# Altium project Thunderscope-E.PrjPCB (part 1 of 2)
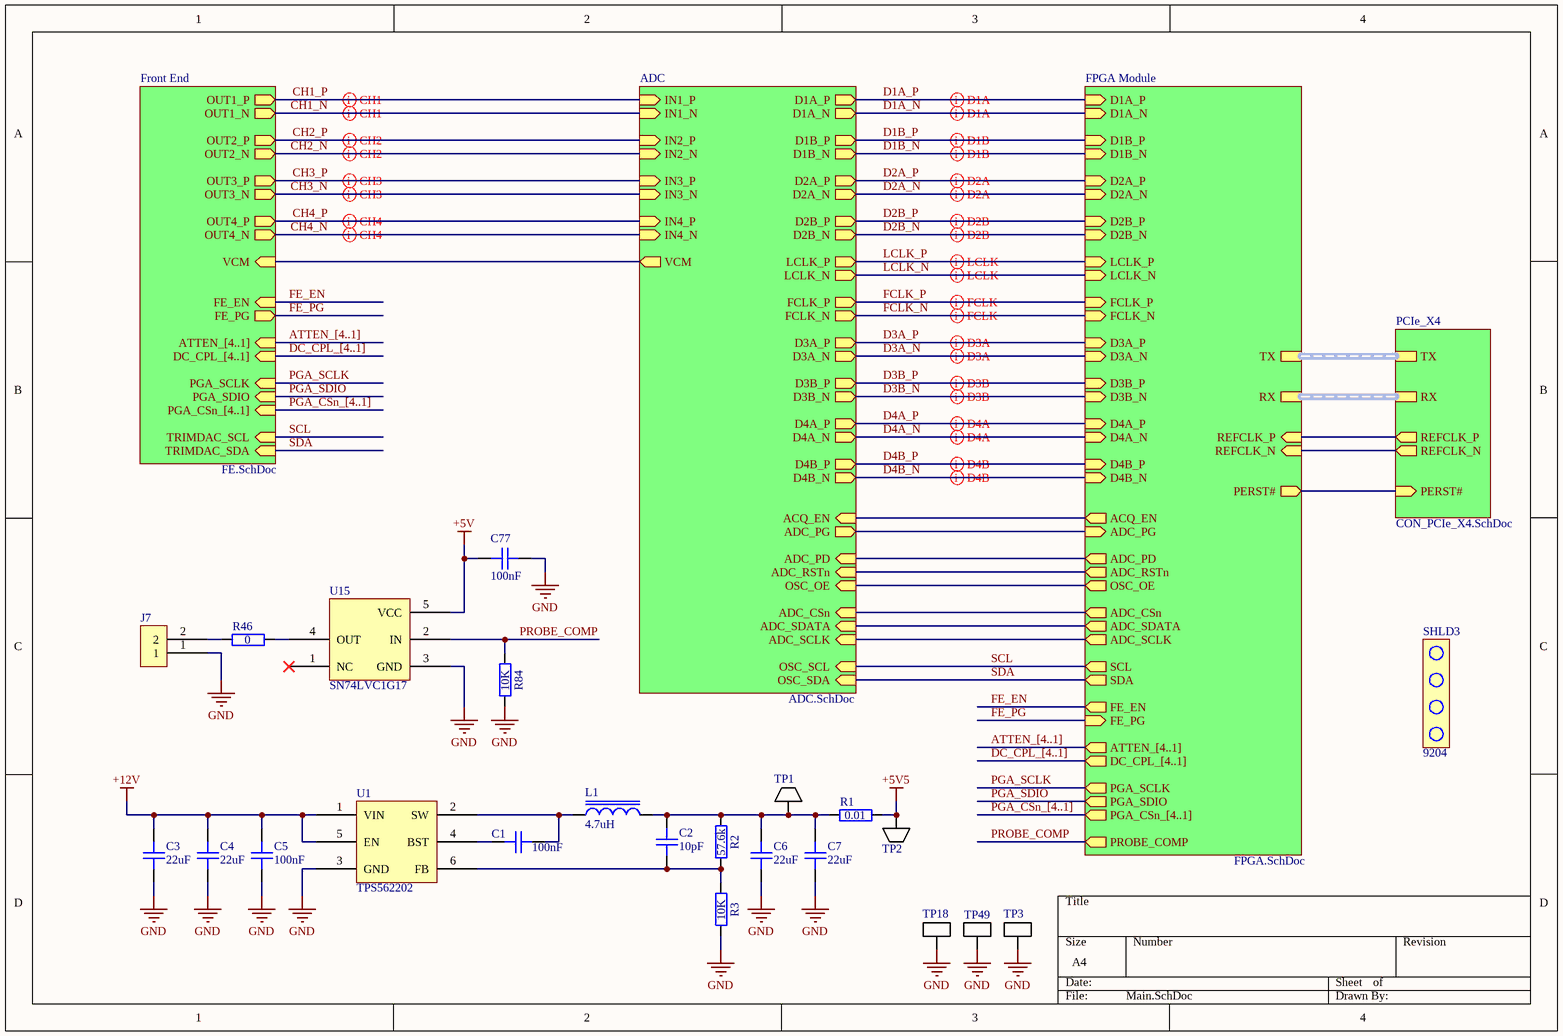
[diagram p0: Main.SchDoc]
Template Notes: - Nominal values used, dimensions in mm  - The mounting holes and keep-out areas around them are only required when the I/O bracket is mounted on the card directly  - Component height rule and clearance rule derived from PCI_Express_CEM_r2.0.pdf, Page 84.  - Stackup is not specified in PCI_Express_CEM_r2.0.pdf, nor implemented in this template.; Template Revision Date: Oct 29, 2010; Template Source Document: Outline:PCI_Express_CEM_r2.0.pdf  Pinout:PCI_Express_CEM_r2.0.pdf; Template Source Organization: PCI-SIG; Template Source Revision Date: R2.0, April 11, 2007; Template Source URL: http://www.pcisig.com
9 sheets, 467 parts. Net scope: hierarchical (ports join the sheet entries above them; power ports are global).
Board file: Thunderscope-E.PCBDOC
Sheets:
  Main.SchDoc
    Front End = FE.SchDoc
      CH1 = FE_Channel.SchDoc
        Input Coupling and Attenuation = Input.SchDoc
        Buffer = Buffer.SchDoc
        PGA = PGA.SchDoc
      CH2 = FE_Channel.SchDoc
        Input Coupling and Attenuation = Input.SchDoc
        Buffer = Buffer.SchDoc
        PGA = PGA.SchDoc
      CH3 = FE_Channel.SchDoc
        Input Coupling and Attenuation = Input.SchDoc
        Buffer = Buffer.SchDoc
        PGA = PGA.SchDoc
      CH4 = FE_Channel.SchDoc
        Input Coupling and Attenuation = Input.SchDoc
        Buffer = Buffer.SchDoc
        PGA = PGA.SchDoc
    ADC = ADC.SchDoc
    FPGA Module = FPGA.SchDoc
    PCIe_X4 = CON_PCIe_X4.SchDoc

## Sheet Main.SchDoc
size A4

### Parts
C1  100nF  [GEN_C_0402]
C2  10pF  [GEN_C_0402]
C3  22uF  [GEN_C_0805]
C4  22uF  [GEN_C_0805]
C5  100nF  [GEN_C_0402]
C6  22uF  [GEN_C_0805]
C7  22uF  [GEN_C_0805]
C77  100nF  [GEN_C_0402]
J7  TSW-101-08-F-D-RA  [GEN_2.54mm_1x2_Pin_TH_RA]  (value not drawn)
L1  4.7uH  [TY_IND_NRS5030]
R1  0.01  [GEN_R_0603]
R2  57.6k  [GEN_R_0402]
R3  10K  [GEN_R_0402]
R46  0  [GEN_R_0402]
R84  10K  [GEN_R_0402]
SHLD3  9204
TP1  5015  [KEY_5015]  (value not drawn)
TP2  5015  [KEY_5015]  (value not drawn)
TP3  5019  [KEY_5019]  (value not drawn)
TP18  5019  [KEY_5019]  (value not drawn)
TP49  5019  [KEY_5019]  (value not drawn)
U1  TPS562202  [TI_SOT563_DRL0006A]
U15  SN74LVC1G17  [GEN_SC-70-5]

### Sub-sheets
ADC = ADC.SchDoc: IN4_N (in), IN4_P (in), IN3_N (in), IN3_P (in), IN2_N (in), IN2_P (in), VCM (out), IN1_N (in), IN1_P (in), ADC_CSn (in), ADC_SDATA (in), ADC_SCLK (in), ADC_RSTn (in), ADC_PD (in), D1A_N (out), D1A_P (out), D1B_P (out), D1B_N (out), D2A_P (out), D2A_N (out), D2B_N (out), D2B_P (out), LCLK_P (out), LCLK_N (out), FCLK_N (out), FCLK_P (out), D3A_P (out), D3A_N (out), D3B_P (out), D3B_N (out), D4A_P (out), D4A_N (out), D4B_P (out), D4B_N (out), ACQ_EN (in), ADC_PG (out), OSC_OE (in), OSC_SDA (in), OSC_SCL (in)
FPGA Module = FPGA.SchDoc: PERST# (out), REFCLK_N (in), REFCLK_P (in), D1A_P (in), D1A_N (in), D1B_P (in), D1B_N (in), D2A_P (in), D2A_N (in), D2B_P (in), D2B_N (in), LCLK_P (in), LCLK_N (in), FCLK_P (in), FCLK_N (in), D3A_P (in), D3A_N (in), D3B_P (in), D3B_N (in), D4A_P (in), D4A_N (in), D4B_P (in), D4B_N (in), ACQ_EN (out), ADC_PG (in), ADC_PD (out), ADC_RSTn (out), OSC_OE (out), ADC_CSn (out), ADC_SDATA (out), ADC_SCLK (out), SCL (out), SDA (out), FE_EN (out), FE_PG (in), ATTEN_[4..1] (out), DC_CPL_[4..1] (out), PGA_SCLK (out), PGA_SDIO (out), PGA_CSn_[4..1] (out), RX (harness PCIe_X4_RX), TX (harness PCIe_X4_TX), PROBE_COMP (out)
Front End = FE.SchDoc: OUT1_P (out), OUT1_N (out), OUT3_P (out), OUT3_N (out), OUT4_N (out), OUT2_N (out), OUT2_P (out), OUT4_P (out), VCM (in), DC_CPL_[4..1] (in), ATTEN_[4..1] (in), PGA_SCLK (in), PGA_CSn_[4..1] (in), PGA_SDIO (in), TRIMDAC_SCL (in), TRIMDAC_SDA (in), FE_EN (in), FE_PG (out)
PCIe_X4 = CON_PCIe_X4.SchDoc: REFCLK_N (out), PERST# (in), REFCLK_P (out), TX (harness PCIe_X4_TX), RX (harness PCIe_X4_RX)

### Nets
+5V: C77.1 U15.5(VCC)
+5V5: R1.2 TP2.1
+12V: C3.2 C4.2 C5.1 U1.1(VIN) U1.5(EN)
GND: C3.1 C4.1 C5.2 C6.1 C7.1 C77.2 J7.1 R3.1 R84.1 TP3.1 TP18.1 TP49.1 U1.3(GND) U15.3(GND)
ACQ_EN: sheet ADC/ACQ_EN, sheet FPGA Module/ACQ_EN
ADC_CSn: sheet ADC/ADC_CSn, sheet FPGA Module/ADC_CSn
ADC_PD: sheet ADC/ADC_PD, sheet FPGA Module/ADC_PD
ADC_PG: sheet ADC/ADC_PG, sheet FPGA Module/ADC_PG
ADC_RSTn: sheet ADC/ADC_RSTn, sheet FPGA Module/ADC_RSTn
ADC_SCLK: sheet ADC/ADC_SCLK, sheet FPGA Module/ADC_SCLK
ADC_SDATA: sheet ADC/ADC_SDATA, sheet FPGA Module/ADC_SDATA
CH1_N: sheet Front End/OUT1_N, sheet ADC/IN1_N
CH1_P: sheet Front End/OUT1_P, sheet ADC/IN1_P
CH2_N: sheet Front End/OUT2_N, sheet ADC/IN2_N
CH2_P: sheet Front End/OUT2_P, sheet ADC/IN2_P
CH3_N: sheet Front End/OUT3_N, sheet ADC/IN3_N
CH3_P: sheet Front End/OUT3_P, sheet ADC/IN3_P
CH4_N: sheet Front End/OUT4_N, sheet ADC/IN4_N
CH4_P: sheet Front End/OUT4_P, sheet ADC/IN4_P
D1A_N: sheet ADC/D1A_N, sheet FPGA Module/D1A_N
D1A_P: sheet ADC/D1A_P, sheet FPGA Module/D1A_P
D1B_N: sheet ADC/D1B_N, sheet FPGA Module/D1B_N
D1B_P: sheet ADC/D1B_P, sheet FPGA Module/D1B_P
D2A_N: sheet ADC/D2A_N, sheet FPGA Module/D2A_N
D2A_P: sheet ADC/D2A_P, sheet FPGA Module/D2A_P
D2B_N: sheet ADC/D2B_N, sheet FPGA Module/D2B_N
D2B_P: sheet ADC/D2B_P, sheet FPGA Module/D2B_P
D3A_N: sheet ADC/D3A_N, sheet FPGA Module/D3A_N
D3A_P: sheet ADC/D3A_P, sheet FPGA Module/D3A_P
D3B_N: sheet ADC/D3B_N, sheet FPGA Module/D3B_N
D3B_P: sheet ADC/D3B_P, sheet FPGA Module/D3B_P
D4A_N: sheet ADC/D4A_N, sheet FPGA Module/D4A_N
D4A_P: sheet ADC/D4A_P, sheet FPGA Module/D4A_P
D4B_N: sheet ADC/D4B_N, sheet FPGA Module/D4B_N
D4B_P: sheet ADC/D4B_P, sheet FPGA Module/D4B_P
FCLK_N: sheet ADC/FCLK_N, sheet FPGA Module/FCLK_N
FCLK_P: sheet ADC/FCLK_P, sheet FPGA Module/FCLK_P
FE_EN: sheet Front End/FE_EN, sheet FPGA Module/FE_EN
FE_PG: sheet Front End/FE_PG, sheet FPGA Module/FE_PG
LCLK_N: sheet ADC/LCLK_N, sheet FPGA Module/LCLK_N
LCLK_P: sheet ADC/LCLK_P, sheet FPGA Module/LCLK_P
OSC_OE: sheet ADC/OSC_OE, sheet FPGA Module/OSC_OE
PERST#: sheet FPGA Module/PERST#, sheet PCIe_X4/PERST#
PGA_SCLK: sheet Front End/PGA_SCLK, sheet FPGA Module/PGA_SCLK
PGA_SDIO: sheet Front End/PGA_SDIO, sheet FPGA Module/PGA_SDIO
PROBE_COMP: R84.2 U15.2(IN) ; sheet FPGA Module/PROBE_COMP
REFCLK_N: sheet FPGA Module/REFCLK_N, sheet PCIe_X4/REFCLK_N
REFCLK_P: sheet FPGA Module/REFCLK_P, sheet PCIe_X4/REFCLK_P
SCL: sheet Front End/TRIMDAC_SCL, sheet ADC/OSC_SCL, sheet FPGA Module/SCL
SDA: sheet Front End/TRIMDAC_SDA, sheet ADC/OSC_SDA, sheet FPGA Module/SDA
VCM: sheet Front End/VCM, sheet ADC/VCM
NetC1_1: C1.1 L1.1 U1.2(SW)
NetC1_2: C1.2 U1.4(BST)
NetC2_1: C2.1 R2.1 R3.2 U1.6(FB)
NetC2_2: C2.2 C6.2 C7.2 L1.2 R1.1 R2.2 TP1.1
NetJ7_2: J7.2 R46.1
NetR46_2: R46.2 U15.4(OUT)

Not connected (* = marked no-connect by the designer): U15 1(NC)*

### Buses and harness runs
bus ATTEN_[4..1] = sheet FPGA Module/ATTEN_[4..1]
bus ATTEN_[4..1] = sheet Front End/ATTEN_[4..1]
bus DC_CPL_[4..1] = sheet FPGA Module/DC_CPL_[4..1]
bus DC_CPL_[4..1] = sheet Front End/DC_CPL_[4..1]
bus PGA_CSn_[4..1] = sheet FPGA Module/PGA_CSn_[4..1]
bus PGA_CSn_[4..1] = sheet Front End/PGA_CSn_[4..1]
harness sheet FPGA Module/RX = sheet PCIe_X4/RX
harness sheet FPGA Module/TX = sheet PCIe_X4/TX

### Layout directives
differential pair: CH1_N, CH1_P, CH2_N, CH2_P, CH3_N, CH3_P, CH4_N, CH4_P, D1A_N, D1A_P, D1B_N, D1B_P, D2A_N, D2A_P, D2B_N, D2B_P, D3A_N, D3A_P, D3B_N, D3B_P, D4A_N, D4A_P, D4B_N, D4B_P, FCLK_N, FCLK_P, LCLK_N, LCLK_P

### Library data of the parts
C1 C5 C77 = CAP 100nF 16V X7R 0402: Voltage Rating: 16V; Package: 0402; Supplier 1: Digi-Key; Supplier Part Number 1: 490-4759-1-ND; Value: 100nF
C2 = CAP 10pF 50V C0G 0402: Temperature Coefficient: C0G; Voltage Rating: 50V; Package: 0402; Value: 10pF; Supplier 1: Digi-Key; Supplier Part Number 1: 1276-1139-1-ND
C3 C4 C6 C7 = CAP 22uF 25V X5R 0805: Voltage Rating: 25V; Package: 0805; Value: 22uF; Supplier 1: Digi-Key; Supplier Part Number 1: 490-10749-1-ND
J7 = CONN 2.54mm 2 Pin TH RA: Supplier 1: Digi-Key; Supplier Part Number 1: SAM12296-ND
L1 = IND 4.7uH 2.6A 35 MOHM SMD: Value: 4.7uH; Supplier 1: Digi-Key; Supplier Part Number 1: 587-3461-1-ND
R1 = RES 0.01 OHM 1% 1/4W 0603: Tolerance: 1%; Power Rating: 0.25W; Supplier 1: Digi-Key; Supplier Part Number 1: 408-1404-1-ND; Value: 0.01; Package: 0603
R2 = RES 57.6K OHM 1% 1/16W 0402: Tolerance: 1%; Power Rating: 0.0625W; Package: 0402; Value: 57.6k; Supplier 1: Digi-Key; Supplier Part Number 1: YAG3190CT-ND
R3 R84 = RES 10K OHM 1% 1/10W 0402: Tolerance: 1%; Power Rating: 0.1W; Package: 0402; Supplier 1: Digi-Key; Supplier Part Number 1: P10.0KLCT-ND; Value: 10K
R46 = RES 0 OHM 1/16W 0402: Power Rating: 0.0625W; Package: 0402; Supplier 1: Digi-Key; Supplier Part Number 1: 311-0.0JRCT-ND; Value: 0
SHLD3 = PCIe IO Shield: Supplier 1: Mouser; Supplier Part Number 1: 534-9204
TP1 TP2 = TP KEYSTONE 5015: Supplier 1: Digi-Key; Supplier Part Number 1: 36-5015CT-ND
TP3 TP18 TP49 = TP KEYSTONE 5019: Supplier 1: Digi-Key; Supplier Part Number 1: 36-5019CT-ND
U1 = IC BUCK TPS562202: Supplier 1: Digi-Key; Supplier Part Number 1: 296-TPS562202DRLRCT-ND
U15 = IC BUFFER SN74LVC1G17: Supplier 1: Digi-Key; Supplier Part Number 1: 296-11934-1-ND

## Sheet FE.SchDoc
size A4
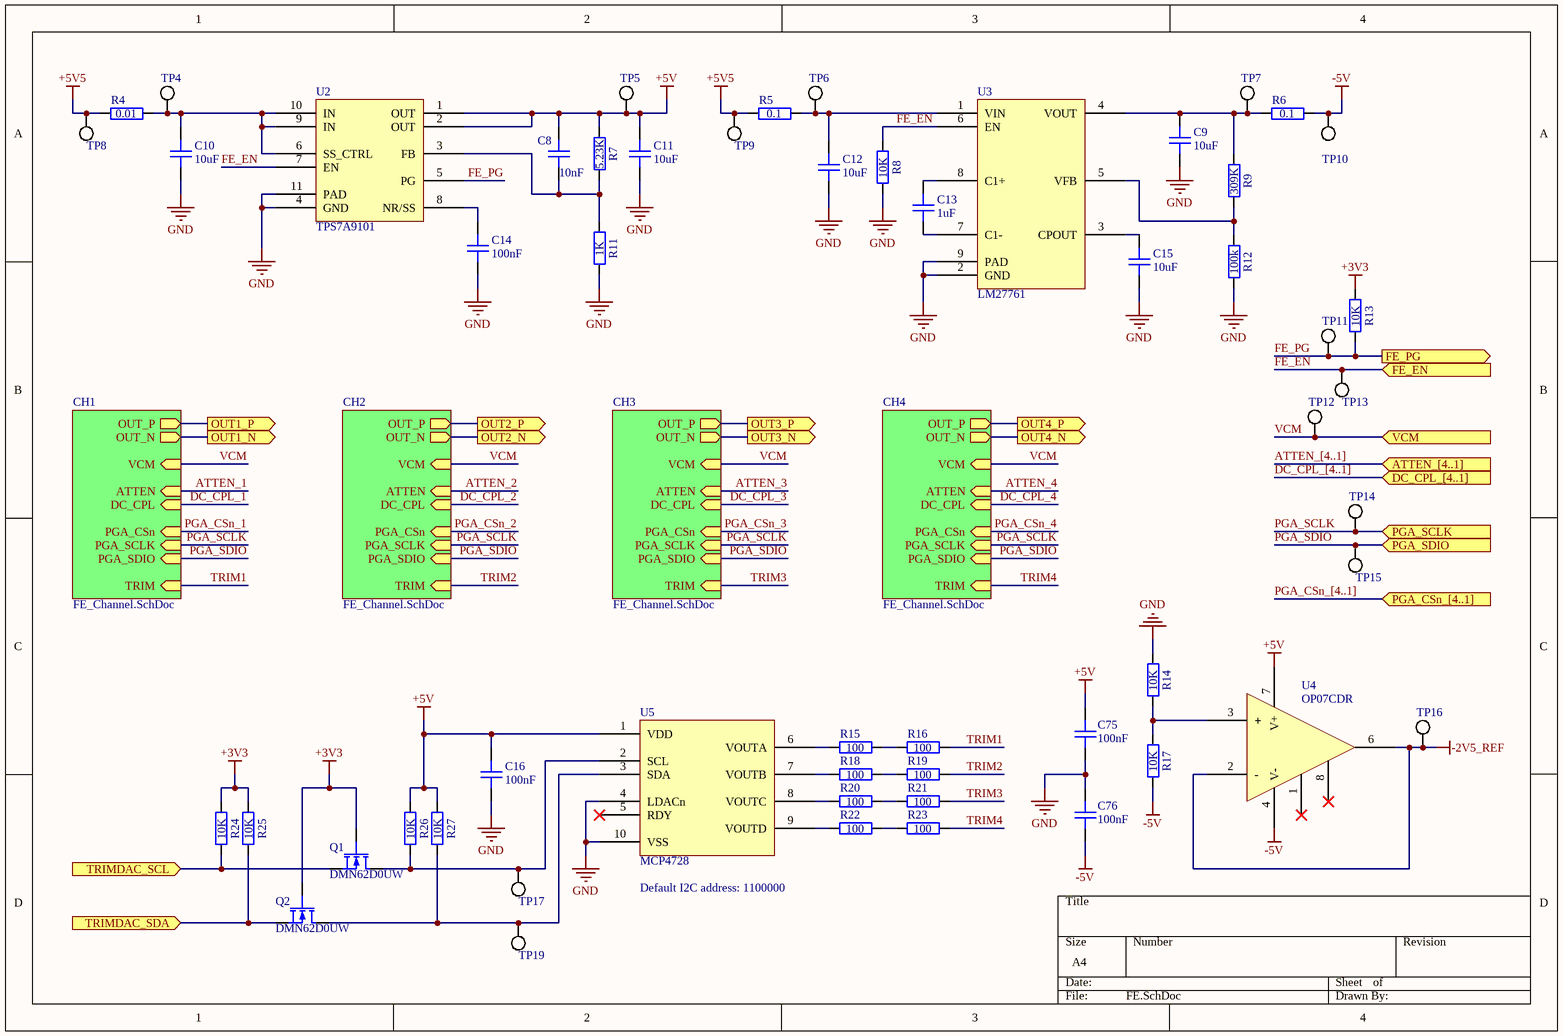
[diagram p1: FE.SchDoc]

### Parts
C8  10nF  [GEN_C_0402]
C9  10uF  [GEN_C_0603]
C10  10uF  [GEN_C_0603]
C11  10uF  [GEN_C_0603]
C12  10uF  [GEN_C_0603]
C13  1uF  [GEN_C_0402]
C14  100nF  [GEN_C_0402]
C15  10uF  [GEN_C_0603]
C16  100nF  [GEN_C_0402]
C75  100nF  [GEN_C_0402]
C76  100nF  [GEN_C_0402]
Q1  DMN62D0UW  [GEN_SOT_323]
Q2  DMN62D0UW  [GEN_SOT_323]
R4  0.01  [GEN_R_0603]
R5  0.1  [GEN_R_0402]
R6  0.1  [GEN_R_0402]
R7  5.23K  [GEN_R_0402]
R8  10K  [GEN_R_0402]
R9  309K  [GEN_R_0402]
R11  1K  [GEN_R_0402]
R12  100k  [GEN_R_0402]
R13  10K  [GEN_R_0402]
R14  10K  [GEN_R_0402]
R15  100  [GEN_R_0402]
R16  100  [GEN_R_0402]
R17  10K  [GEN_R_0402]
R18  100  [GEN_R_0402]
R19  100  [GEN_R_0402]
R20  100  [GEN_R_0402]
R21  100  [GEN_R_0402]
R22  100  [GEN_R_0402]
R23  100  [GEN_R_0402]
R24  10K  [GEN_R_0402]
R25  10K  [GEN_R_0402]
R26  10K  [GEN_R_0402]
R27  10K  [GEN_R_0402]
TP4  PCB  [GEN_TP_PCB]  (value not drawn)  (no BOM)
TP5  PCB  [GEN_TP_PCB]  (value not drawn)  (no BOM)
TP6  PCB  [GEN_TP_PCB]  (value not drawn)  (no BOM)
TP7  PCB  [GEN_TP_PCB]  (value not drawn)  (no BOM)
TP8  PCB  [GEN_TP_PCB]  (value not drawn)  (no BOM)
TP9  PCB  [GEN_TP_PCB]  (value not drawn)  (no BOM)
TP10  PCB  [GEN_TP_PCB]  (value not drawn)  (no BOM)
TP11  PCB  [GEN_TP_PCB]  (value not drawn)  (no BOM)
TP12  PCB  [GEN_TP_PCB]  (value not drawn)  (no BOM)
TP13  PCB  [GEN_TP_PCB]  (value not drawn)  (no BOM)
TP14  PCB  [GEN_TP_PCB]  (value not drawn)  (no BOM)
TP15  PCB  [GEN_TP_PCB]  (value not drawn)  (no BOM)
TP16  PCB  [GEN_TP_PCB]  (value not drawn)  (no BOM)
TP17  PCB  [GEN_TP_PCB]  (value not drawn)  (no BOM)
TP19  PCB  [GEN_TP_PCB]  (value not drawn)  (no BOM)
U2  TPS7A9101  [TI_WSON10_DSK0010A]
U3  LM27761  [TI_WSON8_DSG0008A]
U4  OP07CDR  [TI_SOIC8_D0008A]
U5  MCP4728  [MC_MSOP10_UN]

### Sub-sheets
CH1 = FE_Channel.SchDoc: OUT_P (out), VCM (in), OUT_N (out), TRIM (in), ATTEN (in), DC_CPL (in), PGA_CSn (in), PGA_SCLK (in), PGA_SDIO (in)
CH2 = FE_Channel.SchDoc: OUT_P (out), VCM (in), OUT_N (out), TRIM (in), ATTEN (in), DC_CPL (in), PGA_CSn (in), PGA_SCLK (in), PGA_SDIO (in)
CH3 = FE_Channel.SchDoc: OUT_P (out), VCM (in), OUT_N (out), TRIM (in), ATTEN (in), DC_CPL (in), PGA_CSn (in), PGA_SCLK (in), PGA_SDIO (in)
CH4 = FE_Channel.SchDoc: OUT_P (out), VCM (in), OUT_N (out), TRIM (in), ATTEN (in), DC_CPL (in), PGA_CSn (in), PGA_SCLK (in), PGA_SDIO (in)

### Ports
ATTEN_[4..1] (in), DC_CPL_[4..1] (in), FE_EN (in), FE_PG (out), OUT1_N (out), OUT1_P (out), OUT2_N (out), OUT2_P (out), OUT3_N (out), OUT3_P (out), OUT4_N (out), OUT4_P (out), PGA_CSn_[4..1] (in), PGA_SCLK (in), PGA_SDIO (in), TRIMDAC_SCL (in), TRIMDAC_SDA (in), VCM (in)

### Nets
+3V3: Q1.2(G) Q2.2(G) R13.2 R24.2 R25.2
+5V: C8.2 C11.2 C16.2 C75.1 R7.2 R26.2 R27.2 TP5.1 U2.1(OUT) U2.2(OUT) U4.7(V+) U5.1(VDD)
+5V5: R4.1 R5.1 TP8.1 TP9.1
-2V5_REF: TP16.1 U4.2(-) U4.6(OUT)
-5V: C76.2 R6.2 R17.1 TP10.1 U4.4(V-)
GND: C9.1 C10.1 C11.1 C12.1 C14.1 C15.1 C16.1 C75.2 C76.1 R8.1 R11.1 R12.1 R14.2 U2.4(GND) U2.11(PAD) U3.2(GND) U3.9(PAD) U5.4(LDACn) U5.10(VSS)
CH1_N: port OUT1_N, sheet CH1/OUT_N
CH1_P: port OUT1_P, sheet CH1/OUT_P
CH2_N: port OUT2_N, sheet CH2/OUT_N
CH2_P: port OUT2_P, sheet CH2/OUT_P
CH3_N: port OUT3_N, sheet CH3/OUT_N
CH3_P: port OUT3_P, sheet CH3/OUT_P
CH4_N: port OUT4_N, sheet CH4/OUT_N
CH4_P: port OUT4_P, sheet CH4/OUT_P
FE_EN: R8.2 TP13.1 U2.7(EN) U3.6(EN) ; port FE_EN
FE_PG: R13.1 TP11.1 U2.5(PG) ; port FE_PG
PGA_SCLK: TP14.1 ; port PGA_SCLK, sheet CH1/PGA_SCLK, sheet CH2/PGA_SCLK, sheet CH3/PGA_SCLK, sheet CH4/PGA_SCLK
PGA_SDIO: TP15.1 ; port PGA_SDIO, sheet CH1/PGA_SDIO, sheet CH2/PGA_SDIO, sheet CH3/PGA_SDIO, sheet CH4/PGA_SDIO
SCL: Q1.3(S) R24.1 ; port TRIMDAC_SCL
SDA: Q2.3(S) R25.1 ; port TRIMDAC_SDA
TRIM1: R16.1 ; sheet CH1/TRIM  [project net TRIM]
TRIM2: R19.1 ; sheet CH2/TRIM  [project net TRIM]
TRIM3: R21.1 ; sheet CH3/TRIM  [project net TRIM]
TRIM4: R23.1 ; sheet CH4/TRIM  [project net TRIM]
VCM: TP12.1 ; port VCM, sheet CH1/VCM, sheet CH2/VCM, sheet CH3/VCM, sheet CH4/VCM
NetC8_1: C8.1 R7.1 R11.2 U2.3(FB)
NetC9_2: C9.2 R6.1 R9.2 TP7.1 U3.4(VOUT)
NetC10_2: C10.2 R4.2 TP4.1 U2.6(SS_CTRL) U2.9(IN) U2.10(IN)
NetC12_2: C12.2 R5.2 TP6.1 U3.1(VIN)
NetC13_1: C13.1 U3.7(C1-)
NetC13_2: C13.2 U3.8(C1+)
NetC14_2: C14.2 U2.8(NR/SS)
NetC15_2: C15.2 U3.3(CPOUT)
NetQ1_1: Q1.1(D) R26.1 TP17.1 U5.2(SCL)
NetQ2_1: Q2.1(D) R27.1 TP19.1 U5.3(SDA)
NetR9_1: R9.1 R12.2 U3.5(VFB)
NetR14_1: R14.1 R17.2 U4.3(+)
NetR15_1: R15.1 R16.2
NetR15_2: R15.2 U5.6(VOUTA)
NetR18_1: R18.1 R19.2
NetR18_2: R18.2 U5.7(VOUTB)
NetR20_1: R20.1 R21.2
NetR20_2: R20.2 U5.8(VOUTC)
NetR22_1: R22.1 R23.2
NetR22_2: R22.2 U5.9(VOUTD)

Not connected (* = marked no-connect by the designer): U4 1(N1)* 8(N2)*; U5 5(RDY)*

### Buses and harness runs
bus ATTEN_[4..1] = port ATTEN_[4..1]
bus DC_CPL_[4..1] = port DC_CPL_[4..1]
bus PGA_CSn_[4..1] = port PGA_CSn_[4..1]

### Notes on the sheet
- Default I2C address: 1100000

### Library data of the parts
C8 = CAP 10nF 50V X7R 0402: Voltage Rating: 50V; Package: 0402; Supplier 1: Digi-Key; Supplier Part Number 1: 490-6351-1-ND; Value: 10nF
C9-C12 C15 = CAP 10uF 10V X5R 0603: Voltage Rating: 10V; Package: 0402; Supplier 1: Digi-Key; Supplier Part Number 1: 490-10474-1-ND; Value: 10uF
C13 = CAP 1uF 25V X5R 0402: Voltage Rating: 25V; Package: 0402; Supplier 1: Digi-Key; Supplier Part Number 1: 490-10017-1-ND; Value: 1uF
C14 C16 C75 C76 = CAP 100nF 16V X7R 0402: Voltage Rating: 16V; Package: 0402; Supplier 1: Digi-Key; Supplier Part Number 1: 490-4759-1-ND; Value: 100nF
Q1 Q2 = NMOS DMN62D0UW: Vdss: 60V; Id: 340mA; Max Power: 320mW; Supplier 1: Digi-Key; Supplier Part Number 1: DMN62D0UW-7DICT-ND
R4 = RES 0.01 OHM 1% 1/4W 0603: Tolerance: 1%; Power Rating: 0.25W; Supplier 1: Digi-Key; Supplier Part Number 1: 408-1404-1-ND; Value: 0.01; Package: 0603
R5 R6 = RES 0.1 OHM 1% 1/6W 0402: Tolerance: 1%; Power Rating: 0.16W; Package: 0402; Supplier 1: Digi-Key; Supplier Part Number 1: P.10AKCT-ND; Value: 0.1
R7 = RES 5.23K OHM 1% 1/16W 0402: Tolerance: 1%; Power Rating: 0.0625W; Package: 0402; Value: 5.23K; Supplier 1: Digi-Key; Supplier Part Number 1: YAG3195CT-ND
R8 R13 R14 R17 R24-R27 = RES 10K OHM 1% 1/10W 0402: Tolerance: 1%; Power Rating: 0.1W; Package: 0402; Supplier 1: Digi-Key; Supplier Part Number 1: P10.0KLCT-ND; Value: 10K
R9 = RES 309K OHM 1% 1/16W 0402: Tolerance: 1%; Power Rating: 0.0625W; Package: 0402; Supplier 1: Digi-Key; Supplier Part Number 1: YAG3108CT-ND; Value: 309K
R11 = RES 1K OHM 1% 1/10W 0402: Tolerance: 1%; Power Rating: 0.1W; Package: 0402; Supplier 1: Digi-Key; Supplier Part Number 1: 311-1.00KLRCT-ND; Value: 1K
R12 = RES 100K OHM 1% 1/10W 0402: Tolerance: 1%; Power Rating: 0.1W; Package: 0402; Supplier 1: Digi-Key; Supplier Part Number 1: 311-100KLRCT-ND; Value: 100k
R15 R16 R18-R23 = RES 100 OHM 1% 1/10W 0402: Tolerance: 1%; Power Rating: 0.1W; Package: 0402; Supplier 1: Digi-Key; Supplier Part Number 1: 2019-RK73H1ETTP1000FCT-ND; Value: 100
TP4-TP17 TP19 = TP PCB 1mm
U2 = IC LDO TPS7A9101: Supplier 1: Digi-Key; Supplier Part Number 1: 296-45298-1-ND
U3 = IC CPUMP LM27761: Supplier 1: Digi-Key; Supplier Part Number 1: 296-44379-1-ND
U4 = IC OPAMP OP07CDR: Supplier 1: Digi-Key; Supplier Part Number 1: 296-14626-1-ND
U5 = IC DAC QUAD MCP4728: Supplier 1: Digi-Key; Supplier Part Number 1: MCP4728A1T-E/UNCT-ND

## Sheet FE_Channel.SchDoc
size A4
Used 4 times, as channels Front End/CH1, Front End/CH2, Front End/CH3, Front End/CH4. Parts and nets are listed once, with the designators drawn on the sheet.
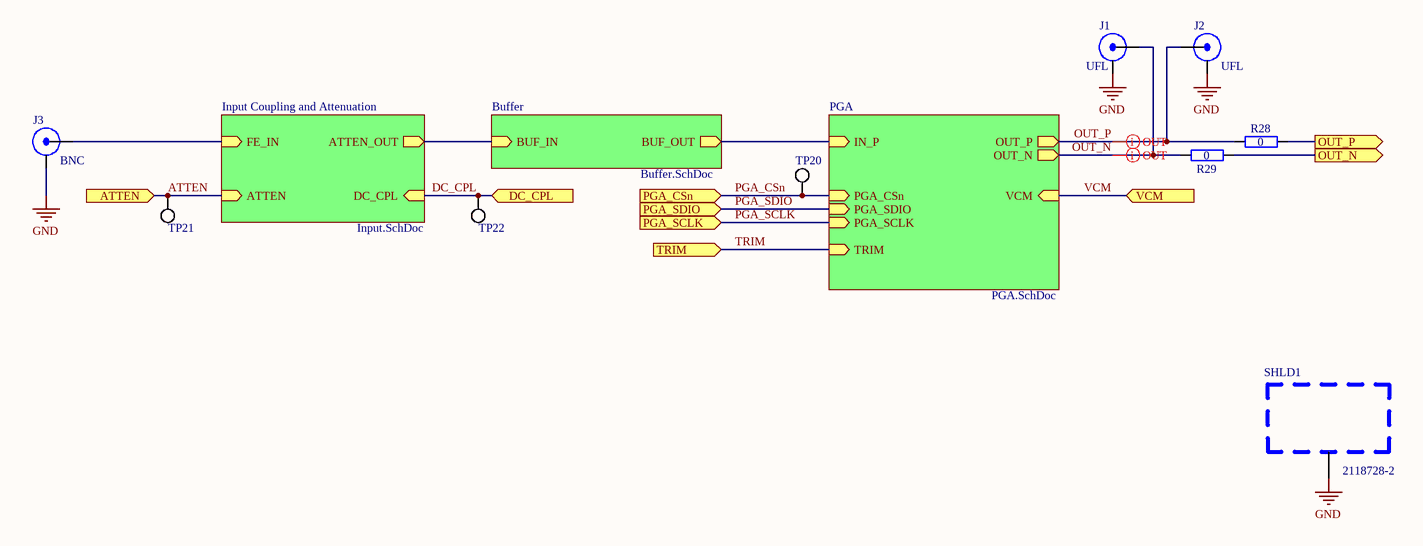
[diagram p2: FE_Channel.SchDoc]

### Parts
J1  UFL  [TE_2334884-1]
J2  UFL  [TE_2334884-1]
J3  BNC  [MOL_0731000105]
R28  0  [GEN_R_0402]
R29  0  [GEN_R_0402]
SHLD1  2118728-2  [TE_2118728-2]
TP20  PCB  [GEN_TP_PCB]  (value not drawn)  (no BOM)
TP21  PCB  [GEN_TP_PCB]  (value not drawn)  (no BOM)
TP22  PCB  [GEN_TP_PCB]  (value not drawn)  (no BOM)

### Sub-sheets
Buffer = Buffer.SchDoc: BUF_IN (in), BUF_OUT (out)
Input Coupling and Attenuation = Input.SchDoc: ATTEN (in), FE_IN (in), ATTEN_OUT (out), DC_CPL (in)
PGA = PGA.SchDoc: IN_P (in), OUT_N (out), PGA_SDIO (in), OUT_P (out), VCM (in), PGA_SCLK (in), PGA_CSn (in), TRIM (in)

### Ports
ATTEN (in), DC_CPL (in), OUT_N (out), OUT_P (out), PGA_CSn (in), PGA_SCLK (in), PGA_SDIO (in), TRIM (in), VCM (in)

### Nets
GND: J1.2(SHIELD) J2.2(SHIELD) J3.2(SHIELD) SHLD1.1
ATTEN: TP21.1 ; port ATTEN, sheet Input Coupling and Attenuation/ATTEN
DC_CPL: TP22.1 ; port DC_CPL, sheet Input Coupling and Attenuation/DC_CPL
OUT_N: R29.2 ; port OUT_N
OUT_N: J1.1(Signal) R29.1 ; sheet PGA/OUT_N  [a separate net that carries the same name]
OUT_P: R28.2 ; port OUT_P
OUT_P: J2.1(Signal) R28.1 ; sheet PGA/OUT_P  [a separate net that carries the same name]
PGA_CSn: TP20.1 ; port PGA_CSn, sheet PGA/PGA_CSn
PGA_SCLK: port PGA_SCLK, sheet PGA/PGA_SCLK
PGA_SDIO: port PGA_SDIO, sheet PGA/PGA_SDIO
TRIM: port TRIM, sheet PGA/TRIM
VCM: port VCM, sheet PGA/VCM
NetJ3_1: J3.1(Signal) ; sheet Input Coupling and Attenuation/FE_IN
(unnamed): sheet Input Coupling and Attenuation/ATTEN_OUT, sheet Buffer/BUF_IN
(unnamed): sheet Buffer/BUF_OUT, sheet PGA/IN_P

### Channels
Front End/CH1: designators end in A; ports ATTEN=ATTEN DC_CPL=DC_CPL OUT_N=CH1_N OUT_P=CH1_P PGA_CSn=PGA_CSn PGA_SCLK=PGA_SCLK PGA_SDIO=PGA_SDIO TRIM=TRIM VCM=VCM
Front End/CH2: designators end in B; ports ATTEN=ATTEN DC_CPL=DC_CPL OUT_N=CH2_N OUT_P=CH2_P PGA_CSn=PGA_CSn PGA_SCLK=PGA_SCLK PGA_SDIO=PGA_SDIO TRIM=TRIM VCM=VCM
Front End/CH3: designators end in C; ports ATTEN=ATTEN DC_CPL=DC_CPL OUT_N=CH3_N OUT_P=CH3_P PGA_CSn=PGA_CSn PGA_SCLK=PGA_SCLK PGA_SDIO=PGA_SDIO TRIM=TRIM VCM=VCM
Front End/CH4: designators end in D; ports ATTEN=ATTEN DC_CPL=DC_CPL OUT_N=CH4_N OUT_P=CH4_P PGA_CSn=PGA_CSn PGA_SCLK=PGA_SCLK PGA_SDIO=PGA_SDIO TRIM=TRIM VCM=VCM

### Layout directives
differential pair: OUT_N_CH1, OUT_P_CH1

### Library data of the parts
J1 J2 = UFL Jack SMD: Supplier 1: Digi-Key; Supplier Part Number 1: A145155CT-ND
J3 = BNC JACK R/A: Supplier 1: Digi-Key; Supplier Part Number 1: WM5524-ND
R28 R29 = RES 0 OHM 1/16W 0402: Power Rating: 0.0625W; Package: 0402; Supplier 1: Digi-Key; Supplier Part Number 1: 311-0.0JRCT-ND; Value: 0
SHLD1 = SHIELD 2118728-2: Supplier 1: Digi-Key; Supplier Part Number 1: A126158CT-ND
TP20-TP22 = TP PCB 1mm

## Sheet Input.SchDoc
size A4
Used 4 times, as channels Front End/CH1/Input Coupling and Attenuation, Front End/CH2/Input Coupling and Attenuation, Front End/CH3/Input Coupling and Attenuation, Front End/CH4/Input Coupling and Attenuation. Parts and nets are listed once, with the designators drawn on the sheet.
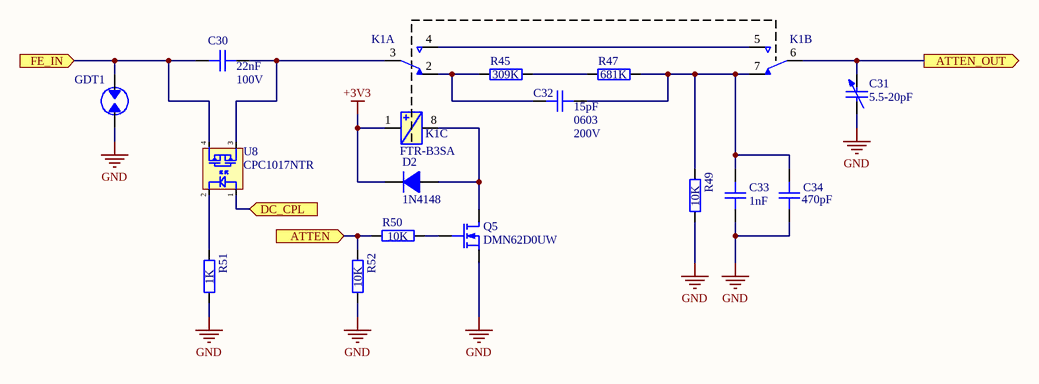
[diagram p3: Input.SchDoc]

### Parts
C30  22nF  Voltage Rating: 100V  [GEN_C_0603]
C31  5.5-20pF  [EW_TRIMCAP]
C32  15pF  Package: 0603  Voltage Rating: 200V  [GEN_C_0603]
C33  1nF  [GEN_C_0402]
C34  470pF  [GEN_C_0402]
D2  1N4148  [GEN_SOD_323]
GDT1  GDT  [BOU_2051]  (value not drawn)
K1  FTR-B3SA  [FUJ_FTR-B3SA]  (value not drawn)  (parts A,B,C of 3)
Q5  DMN62D0UW  [GEN_SOT_323]
R45  309K  [GEN_R_0402]
R47  681K  [GEN_R_0402]
R49  10K  [GEN_R_0402]
R50  10K  [GEN_R_0402]
R51  1K  [GEN_R_0402]
R52  10K  [GEN_R_0402]
U8  CPC1017NTR  [IXY_CPC1017]

### Ports
ATTEN (in), ATTEN_OUT (out), DC_CPL (in), FE_IN (in)

### Nets
+3V3: D2.1(K) K1.1
GND: C31.2 C33.1 C34.1 GDT1.2 Q5.3(S) R49.1 R51.1 R52.1
ATTEN: R50.2 R52.2 ; port ATTEN
ATTEN_OUT: C31.1 K1.6 ; port ATTEN_OUT
DC_CPL: U8.1 ; port DC_CPL
FE_IN: C30.2 GDT1.1 U8.4 ; port FE_IN
NetC30_1: C30.1 K1.3 U8.3
NetC32_1: C32.1 C33.2 C34.2 K1.7 R47.2 R49.2
NetC32_2: C32.2 K1.2 R45.1
NetD2_2: D2.2(A) K1.8 Q5.1(D)
NetK1_4: K1.4 K1.5
NetQ5_2: Q5.2(G) R50.1
NetR45_2: R45.2 R47.1
NetR51_2: R51.2 U8.2

### Channels
Front End/CH1/Input Coupling and Attenuation: designators end in A; ports ATTEN=ATTEN ATTEN_OUT=ATTEN_OUT DC_CPL=DC_CPL FE_IN=FE_IN
Front End/CH2/Input Coupling and Attenuation: designators end in B; ports ATTEN=ATTEN ATTEN_OUT=ATTEN_OUT DC_CPL=DC_CPL FE_IN=FE_IN
Front End/CH3/Input Coupling and Attenuation: designators end in C; ports ATTEN=ATTEN ATTEN_OUT=ATTEN_OUT DC_CPL=DC_CPL FE_IN=FE_IN
Front End/CH4/Input Coupling and Attenuation: designators end in D; ports ATTEN=ATTEN ATTEN_OUT=ATTEN_OUT DC_CPL=DC_CPL FE_IN=FE_IN

### Library data of the parts
C30 = CAP 22nF 100V X7R 0603: Package: 0603; Supplier 1: Digi-Key; Supplier Part Number 1: 490-4782-1-ND; Value: 22nF
C31 = CAP TRIMMER 5.5-20PF 500V: Value: 5.5-20pF; Supplier 1: Digikey; Supplier Part Number 1: 2447-SGC3S200NMCT-ND
C32 = CAP 15pF 200V C0G 0603: Supplier 1: Digi-Key; Supplier Part Number 1: 478-10254-1-ND; Value: 15pF
C33 = CAP 1nF 50V C0G 0402: Voltage Rating: 50V; Package: 0402; Supplier 1: Digi-Key; Supplier Part Number 1: 490-6189-1-ND; Value: 1nF
C34 = CAP 470pF 50V C0G 0402: Voltage Rating: 50V; Temperature Coefficient: C0G; Package: 0402; Supplier 1: Digi-Key; Supplier Part Number 1: 490-8207-1-ND; Value: 470pF
D2 = DIODE 1N4148: Max Reverse Voltage: 75V; Max Current: 150mA; Supplier 1: Digi-Key; Supplier Part Number 1: 1N4148WS-FDICT-ND
GDT1 = GDT 90V: Supplier 1: Digi-Key; Supplier Part Number 1: 2051-09-SM-RPLFCT-ND
K1 = RELAY DPDT-NO FTR-B3SA
Q5 = NMOS DMN62D0UW: Vdss: 60V; Id: 340mA; Max Power: 320mW; Supplier 1: Digi-Key; Supplier Part Number 1: DMN62D0UW-7DICT-ND
R45 = RES 309K OHM 1% 1/16W 0402: Tolerance: 1%; Power Rating: 0.0625W; Package: 0402; Supplier 1: Digi-Key; Supplier Part Number 1: YAG3108CT-ND; Value: 309K
R47 = RES 681K OHM 1% 1/16W 0402: Tolerance: 1%; Power Rating: 0.0625W; Package: 0402; Supplier 1: Digi-Key; Supplier Part Number 1: YAG3212CT-ND; Value: 681K
R49 R50 R52 = RES 10K OHM 1% 1/10W 0402: Tolerance: 1%; Power Rating: 0.1W; Package: 0402; Supplier 1: Digi-Key; Supplier Part Number 1: P10.0KLCT-ND; Value: 10K
R51 = RES 1K OHM 1% 1/10W 0402: Tolerance: 1%; Power Rating: 0.1W; Package: 0402; Supplier 1: Digi-Key; Supplier Part Number 1: P1.00KLCT-ND; Value: 1K
U8 = SSR CPC1017NTR: Supplier 1: Digi-Key; Supplier Part Number 1: CLA233CT-ND

## Sheet Buffer.SchDoc
size A4
Used 4 times, as channels Front End/CH1/Buffer, Front End/CH2/Buffer, Front End/CH3/Buffer, Front End/CH4/Buffer. Parts and nets are listed once, with the designators drawn on the sheet.
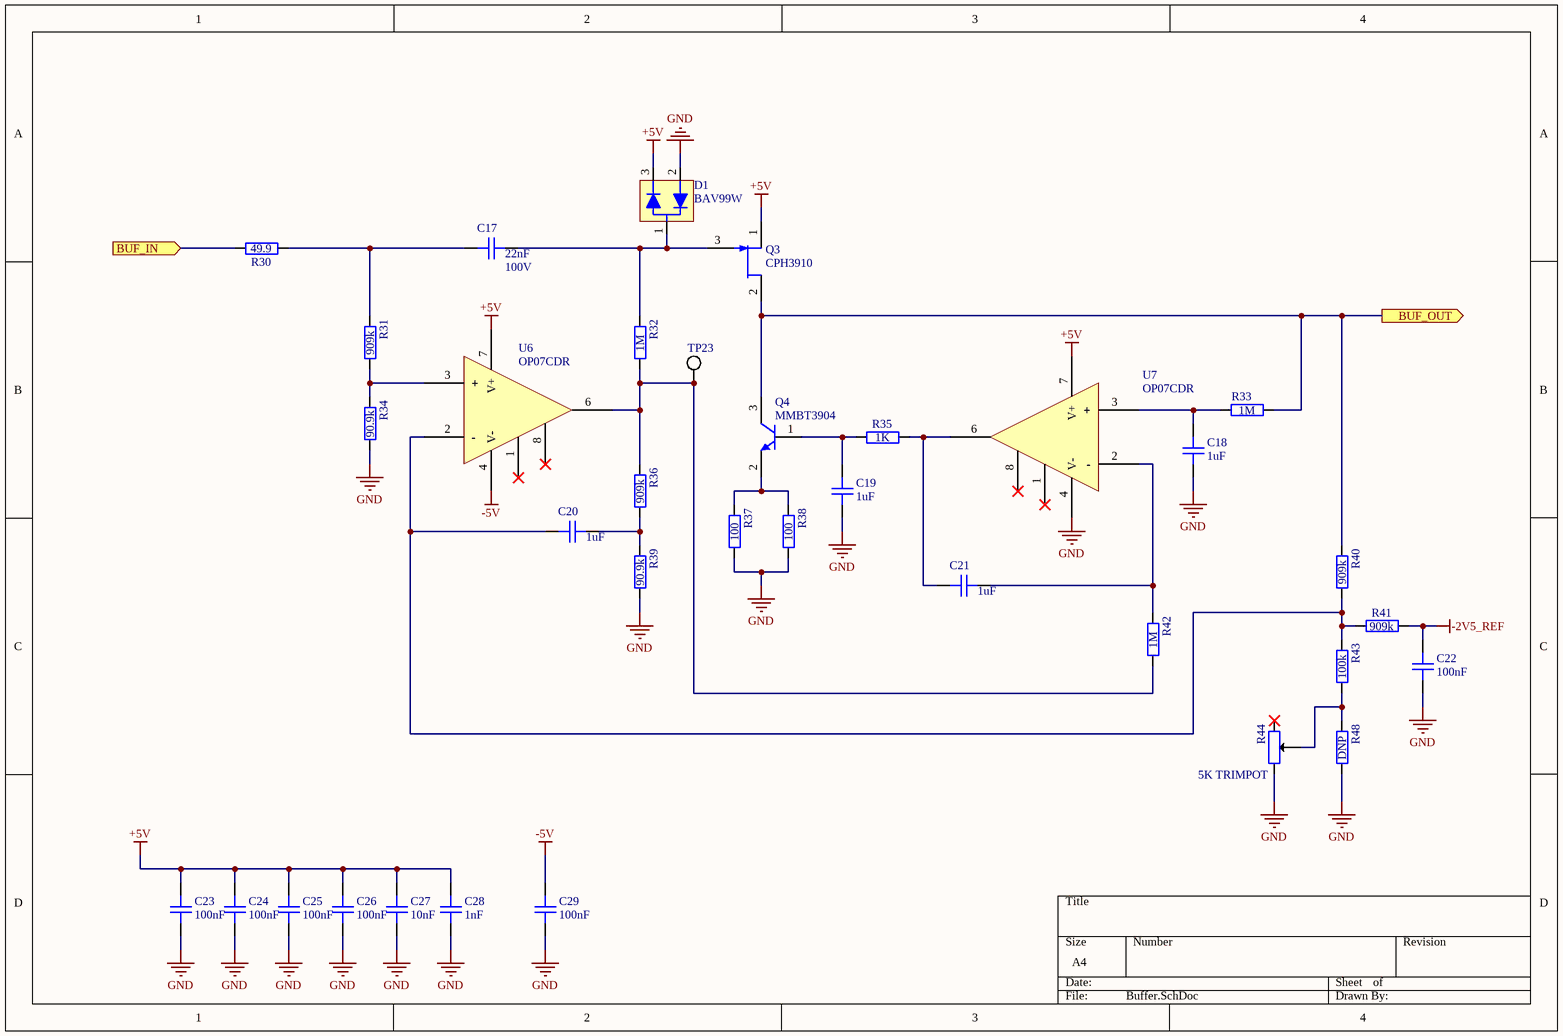
[diagram p4: Buffer.SchDoc]

### Parts
C17  22nF  Voltage Rating: 100V  [GEN_C_0603]
C18  1uF  [GEN_C_0402]
C19  1uF  [GEN_C_0402]
C20  1uF  [GEN_C_0402]
C21  1uF  [GEN_C_0402]
C22  100nF  [GEN_C_0402]
C23  100nF  [GEN_C_0402]
C24  100nF  [GEN_C_0402]
C25  100nF  [GEN_C_0402]
C26  100nF  [GEN_C_0402]
C27  10nF  [GEN_C_0402]
C28  1nF  [GEN_C_0402]
C29  100nF  [GEN_C_0402]
D1  BAV99W  [GEN_SOT_323]
Q3  CPH3910  [ON_SOT23_CPH3]
Q4  MMBT3904  [MMC_SOT23]
R30  49.9  [GEN_R_0402]
R31  909k  [GEN_R_0402]
R32  1M  [GEN_R_0402]
R33  1M  [GEN_R_0402]
R34  90.9k  [GEN_R_0402]
R35  1K  [GEN_R_0402]
R36  909k  [GEN_R_0402]
R37  100  [GEN_R_0402]
R38  100  [GEN_R_0402]
R39  90.9k  [GEN_R_0402]
R40  909k  [GEN_R_0402]
R41  909k  [GEN_R_0402]
R42  1M  [GEN_R_0402]
R43  100k  [GEN_R_0402]
R44  5K TRIMPOT  [BOU_3mm_POT]
R48  DNP  [GEN_R_0402]  (no BOM)
TP23  PCB  [GEN_TP_PCB]  (value not drawn)  (no BOM)
U6  OP07CDR  [TI_SOIC8_D0008A]
U7  OP07CDR  [TI_SOIC8_D0008A]

### Ports
BUF_IN (in), BUF_OUT (out)

### Nets
+5V: C23.1 C24.1 C25.1 C26.1 C27.2 C28.2 D1.3 Q3.1(S) U6.7(V+) U7.7(V+)
-2V5_REF: C22.1 R41.1
-5V: C29.1 U6.4(V-)
GND: C18.1 C19.1 C22.2 C23.2 C24.2 C25.2 C26.2 C27.1 C28.1 C29.2 D1.2 R34.1 R37.1 R38.1 R39.1 R44.3 R48.1 U7.4(V-)
BUF_IN: R30.1 ; port BUF_IN
BUF_OUT: Q3.2(D) Q4.3(C) R33.1 R40.2 ; port BUF_OUT
NetC17_1: C17.1 D1.1 Q3.3(G) R32.2
NetC17_2: C17.2 R30.2 R31.2
NetC18_2: C18.2 R33.2 U7.3(+)
NetC19_2: C19.2 Q4.1(B) R35.1
NetC20_1: C20.1 R36.1 R39.2
NetC20_2: C20.2 R40.1 R41.2 R43.2 U6.2(-)
NetC21_1: C21.1 R42.2 U7.2(-)
NetC21_2: C21.2 R35.2 U7.6(OUT)
NetQ4_2: Q4.2(E) R37.2 R38.2
NetR31_1: R31.1 R34.2 U6.3(+)
NetR32_1: R32.1 R36.2 R42.1 TP23.1 U6.6(OUT)
NetR43_1: R43.1 R44.2 R48.2

Not connected (* = marked no-connect by the designer): R44 1*; U6 1(N1)* 8(N2)*; U7 1(N1)* 8(N2)*

### Channels
Front End/CH1/Buffer: designators end in A; ports BUF_IN=ATTEN_OUT BUF_OUT=BUF_OUT
Front End/CH2/Buffer: designators end in B; ports BUF_IN=ATTEN_OUT BUF_OUT=BUF_OUT
Front End/CH3/Buffer: designators end in C; ports BUF_IN=ATTEN_OUT BUF_OUT=BUF_OUT
Front End/CH4/Buffer: designators end in D; ports BUF_IN=ATTEN_OUT BUF_OUT=BUF_OUT

### Library data of the parts
C17 = CAP 22nF 100V X7R 0603: Package: 0603; Value: 22nF; Supplier 1: Digi-Key; Supplier Part Number 1: 490-4782-1-ND
C18-C21 = CAP 1uF 25V X5R 0402: Voltage Rating: 25V; Package: 0402; Supplier 1: Digi-Key; Supplier Part Number 1: 490-10017-1-ND; Value: 1uF
C22-C26 C29 = CAP 100nF 16V X7R 0402: Voltage Rating: 16V; Package: 0402; Supplier 1: Digi-Key; Supplier Part Number 1: 490-4759-1-ND; Value: 100nF
C27 = CAP 10nF 50V X7R 0402: Voltage Rating: 50V; Package: 0402; Supplier 1: Digi-Key; Supplier Part Number 1: 490-4762-1-ND; Value: 10nF
C28 = CAP 1nF 50V C0G 0402: Voltage Rating: 50V; Package: 0402; Supplier 1: Digi-Key; Supplier Part Number 1: 490-6189-1-ND; Value: 1nF
D1 = DIODE ARRAY BAV99W: Supplier 1: Digi-Key; Supplier Part Number 1: BAV99W-FDICT-ND
Q3 = NJFET CPH3910: Supplier 1: Digi-Key; Supplier Part Number 1: CPH3910-TL-EOSCT-ND
Q4 = NPN MMBT3904: Supplier 1: Digi-Key; Supplier Part Number 1: MMBT3904TPMSCT-ND
R30 = RES 49.9 OHM 1% 1/10W 0402: Tolerance: 1%; Power Rating: 0.1W; Package: 0402; Supplier 1: Digi-Key; Supplier Part Number 1: P49.9LCT-ND; Value: 49.9
R31 R36 R40 R41 = RES 909K OHM 1% 1/16W 0402: Tolerance: 1%; Power Rating: 0.0625W; Package: 0402; Supplier 1: Digi-Key; Supplier Part Number 1: YAG2377CT-ND; Value: 909k
R32 R33 R42 = RES 1M OHM 1% 1/10W 0402: Tolerance: 1%; Power Rating: 0.1W; Package: 0402; Supplier 1: Digi-Key; Supplier Part Number 1: P1.00MLCT-ND; Value: 1M
R34 R39 = RES 90.9K OHM 1% 1/16W 0402: Tolerance: 1%; Power Rating: 0.0625W; Package: 0402; Supplier 1: Digi-Key; Supplier Part Number 1: 311-90.9KLRCT-ND; Value: 90.9k
R35 = RES 1K OHM 1% 1/10W 0402: Tolerance: 1%; Power Rating: 0.1W; Package: 0402; Supplier 1: Digi-Key; Supplier Part Number 1: P1.00KLCT-ND; Value: 1K
R37 R38 = RES 100 OHM 1% 1/10W 0402: Tolerance: 1%; Power Rating: 0.1W; Package: 0402; Supplier 1: Digi-Key; Supplier Part Number 1: P100LCT-ND; Value: 100
R43 = RES 100K OHM 1% 1/10W 0402: Tolerance: 1%; Power Rating: 0.1W; Package: 0402; Supplier 1: Digi-Key; Supplier Part Number 1: P100KLCT-ND; Value: 100k
R44 = TRIMMER 5K OHM 0.1W J LEAD TOP: Tolerance: 1%; Power Rating: 0.1W; Supplier 1: Digi-Key; Supplier Part Number 1: TC33X-502ECT-ND; Value: 5K
R48 = RES DNP 0402: Tolerance: 1%; Power Rating: 0.0625W; Package: 0402; Value: DNP
TP23 = TP PCB 1mm
U6 U7 = IC OPAMP OP07CDR: Supplier 1: Digi-Key; Supplier Part Number 1: 296-14626-1-ND

## Sheet PGA.SchDoc
size A4
Used 4 times, as channels Front End/CH1/PGA, Front End/CH2/PGA, Front End/CH3/PGA, Front End/CH4/PGA. Parts and nets are listed once, with the designators drawn on the sheet.
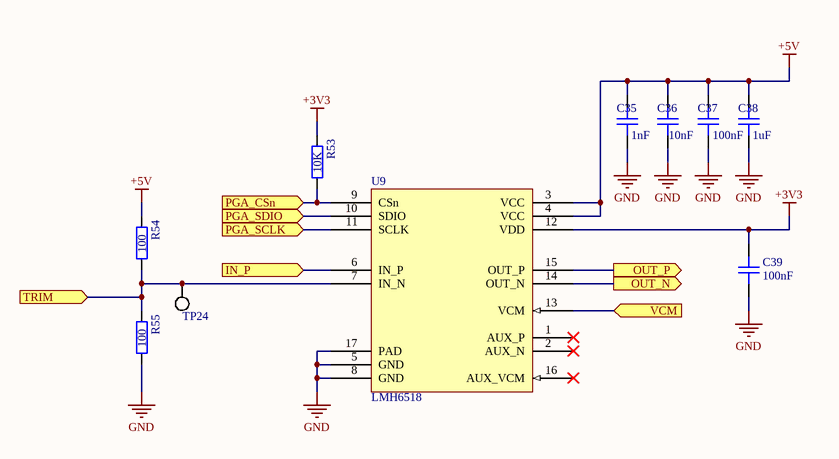
[diagram p5: PGA.SchDoc]

### Parts
C35  1nF  [GEN_C_0402]
C36  10nF  [GEN_C_0402]
C37  100nF  [GEN_C_0402]
C38  1uF  [GEN_C_0402]
C39  100nF  [GEN_C_0402]
R53  10K  [GEN_R_0402]
R54  100  [GEN_R_0402]
R55  100  [GEN_R_0402]
TP24  PCB  [GEN_TP_PCB]  (value not drawn)  (no BOM)
U9  LMH6518  [TI_WQFN_RGH0016A]

### Ports
IN_P (in), OUT_N (out), OUT_P (out), PGA_CSn (in), PGA_SCLK (in), PGA_SDIO (in), TRIM (in), VCM (in)

### Nets
+3V3: C39.2 R53.2 U9.12(VDD)
+5V: C35.2 C36.2 C37.2 C38.2 R54.2 U9.3(VCC) U9.4(VCC)
GND: C35.1 C36.1 C37.1 C38.1 C39.1 R55.1 U9.5(GND) U9.8(GND) U9.17(PAD)
IN_P: U9.6(IN_P) ; port IN_P
OUT_N: U9.14(OUT_N) ; port OUT_N
OUT_P: U9.15(OUT_P) ; port OUT_P
PGA_CSn: R53.1 U9.9(CSn) ; port PGA_CSn
PGA_SCLK: U9.11(SCLK) ; port PGA_SCLK
PGA_SDIO: U9.10(SDIO) ; port PGA_SDIO
TRIM: R54.1 R55.2 TP24.1 U9.7(IN_N) ; port TRIM
VCM: U9.13(VCM) ; port VCM

Not connected (* = marked no-connect by the designer): U9 1(AUX_P)* 2(AUX_N)* 16(AUX_VCM)*

### Channels
Front End/CH1/PGA: designators end in A; ports IN_P=BUF_OUT OUT_N=OUT_N_CH1 OUT_P=OUT_P_CH1 PGA_CSn=PGA_CSn PGA_SCLK=PGA_SCLK PGA_SDIO=PGA_SDIO TRIM=TRIM VCM=VCM
Front End/CH2/PGA: designators end in B; ports IN_P=BUF_OUT OUT_N=OUT_N_CH2 OUT_P=OUT_P_CH2 PGA_CSn=PGA_CSn PGA_SCLK=PGA_SCLK PGA_SDIO=PGA_SDIO TRIM=TRIM VCM=VCM
Front End/CH3/PGA: designators end in C; ports IN_P=BUF_OUT OUT_N=OUT_N_CH3 OUT_P=OUT_P_CH3 PGA_CSn=PGA_CSn PGA_SCLK=PGA_SCLK PGA_SDIO=PGA_SDIO TRIM=TRIM VCM=VCM
Front End/CH4/PGA: designators end in D; ports IN_P=BUF_OUT OUT_N=OUT_N_CH4 OUT_P=OUT_P_CH4 PGA_CSn=PGA_CSn PGA_SCLK=PGA_SCLK PGA_SDIO=PGA_SDIO TRIM=TRIM VCM=VCM

### Library data of the parts
C35 = CAP 1nF 50V C0G 0402: Voltage Rating: 50V; Package: 0402; Supplier 1: Digi-Key; Supplier Part Number 1: 490-6189-1-ND; Value: 1nF
C36 = CAP 10nF 50V X7R 0402: Voltage Rating: 50V; Package: 0402; Supplier 1: Digi-Key; Supplier Part Number 1: 490-6351-1-ND; Value: 10nF
C37 C39 = CAP 100nF 16V X7R 0402: Voltage Rating: 16V; Package: 0402; Supplier 1: Digi-Key; Supplier Part Number 1: 490-4759-1-ND; Value: 100nF
C38 = CAP 1uF 25V X5R 0402: Voltage Rating: 25V; Package: 0402; Supplier 1: Digi-Key; Supplier Part Number 1: 490-10017-1-ND; Value: 1uF
R53 = RES 10K OHM 1% 1/10W 0402: Tolerance: 1%; Power Rating: 0.1W; Package: 0402; Supplier 1: Digi-Key; Supplier Part Number 1: P10.0KLCT-ND; Value: 10K
R54 R55 = RES 100 OHM 1% 1/10W 0402: Tolerance: 1%; Power Rating: 0.1W; Package: 0402; Supplier 1: Digi-Key; Supplier Part Number 1: 2019-RK73H1ETTP1000FCT-ND; Value: 100
TP24 = TP PCB 1mm
U9 = IC PGA LMH6518: Supplier 1: Digi-Key; Supplier Part Number 1: LMH6518SQE/NOPBCT-ND

## Sheet ADC.SchDoc
size A4
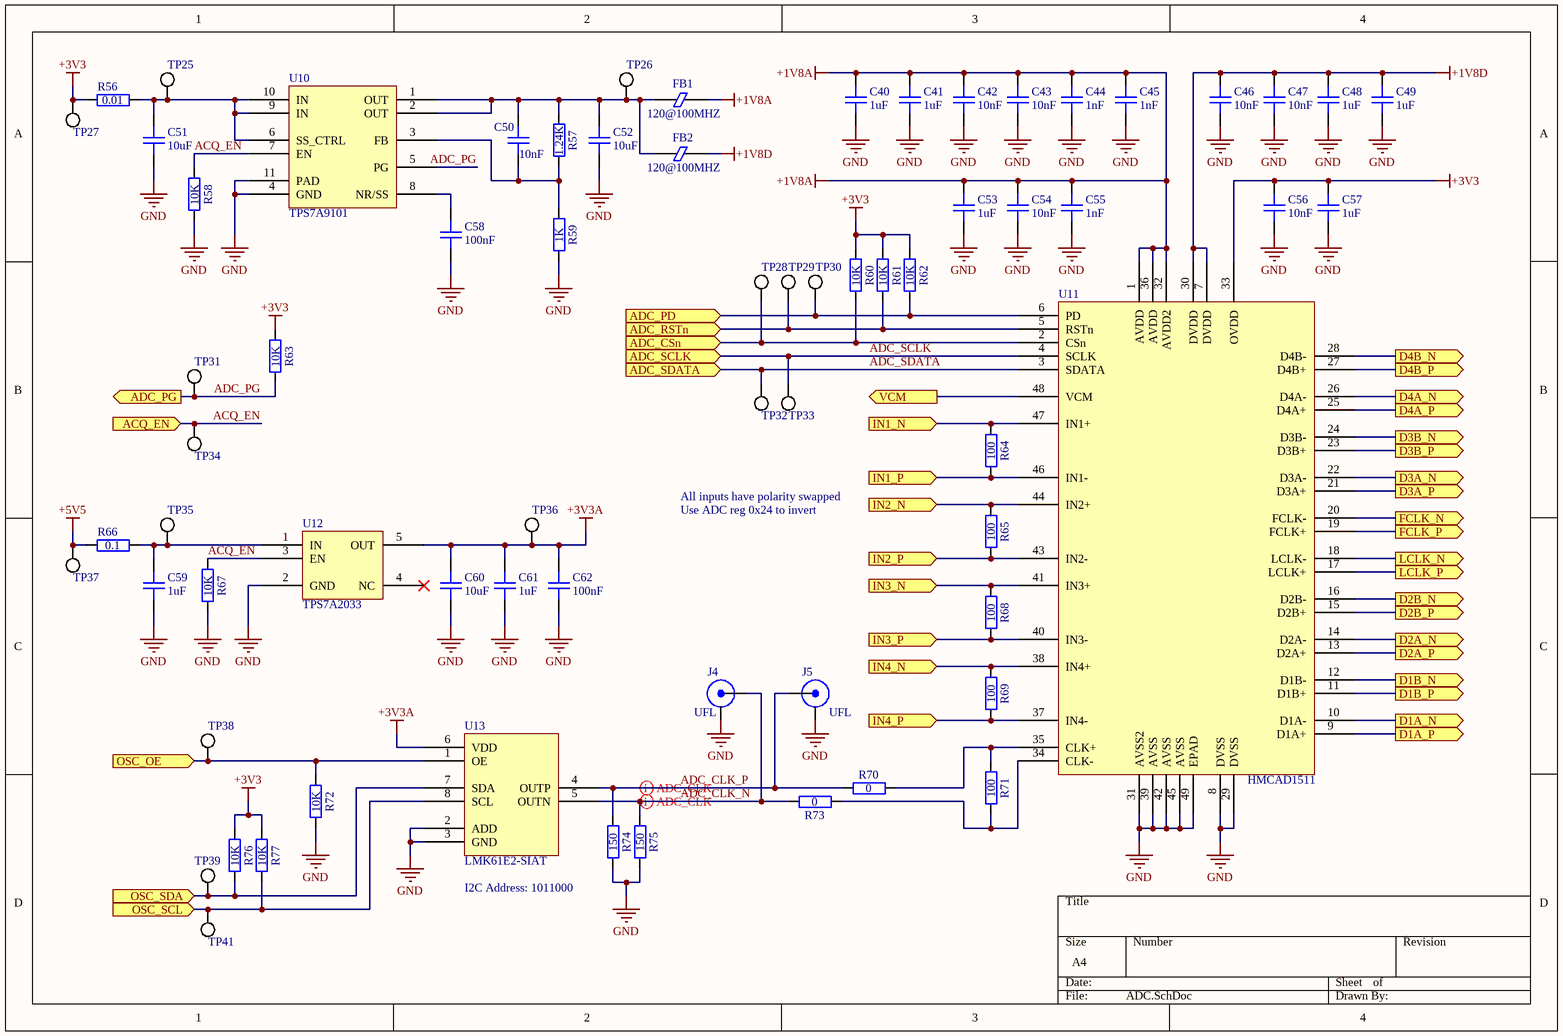
[diagram p6: ADC.SchDoc]

### Parts
C40  1uF  [GEN_C_0402]
C41  1uF  [GEN_C_0402]
C42  10nF  [GEN_C_0402]
C43  10nF  [GEN_C_0402]
C44  1nF  [GEN_C_0402]
C45  1nF  [GEN_C_0402]
C46  10nF  [GEN_C_0402]
C47  10nF  [GEN_C_0402]
C48  1uF  [GEN_C_0402]
C49  1uF  [GEN_C_0402]
C50  10nF  [GEN_C_0402]
C51  10uF  [GEN_C_0603]
C52  10uF  [GEN_C_0603]
C53  1uF  [GEN_C_0402]
C54  10nF  [GEN_C_0402]
C55  1nF  [GEN_C_0402]
C56  10nF  [GEN_C_0402]
C57  1uF  [GEN_C_0402]
C58  100nF  [GEN_C_0402]
C59  1uF  [GEN_C_0402]
C60  10uF  [GEN_C_0603]
C61  1uF  [GEN_C_0402]
C62  100nF  [GEN_C_0402]
FB1  120@100MHZ  [GEN_R_0402]
FB2  120@100MHZ  [GEN_R_0402]
J4  UFL  [TE_2334884-1]
J5  UFL  [TE_2334884-1]
R56  0.01  [GEN_R_0603]
R57  1.24K  [GEN_R_0402]
R58  10K  [GEN_R_0402]
R59  1K  [GEN_R_0402]
R60  10K  [GEN_R_0402]
R61  10K  [GEN_R_0402]
R62  10K  [GEN_R_0402]
R63  10K  [GEN_R_0402]
R64  100  [GEN_R_0402]
R65  100  [GEN_R_0402]
R66  0.1  [GEN_R_0402]
R67  10K  [GEN_R_0402]
R68  100  [GEN_R_0402]
R69  100  [GEN_R_0402]
R70  0  [GEN_R_0402]
R71  100  [GEN_R_0402]
R72  10K  [GEN_R_0402]
R73  0  [GEN_R_0402]
R74  150  [GEN_R_0402]
R75  150  [GEN_R_0402]
R76  10K  [GEN_R_0402]
R77  10K  [GEN_R_0402]
TP25  PCB  [GEN_TP_PCB]  (value not drawn)  (no BOM)
TP26  PCB  [GEN_TP_PCB]  (value not drawn)  (no BOM)
TP27  PCB  [GEN_TP_PCB]  (value not drawn)  (no BOM)
TP28  PCB  [GEN_TP_PCB]  (value not drawn)  (no BOM)
TP29  PCB  [GEN_TP_PCB]  (value not drawn)  (no BOM)
TP30  PCB  [GEN_TP_PCB]  (value not drawn)  (no BOM)
TP31  PCB  [GEN_TP_PCB]  (value not drawn)  (no BOM)
TP32  PCB  [GEN_TP_PCB]  (value not drawn)  (no BOM)
TP33  PCB  [GEN_TP_PCB]  (value not drawn)  (no BOM)
TP34  PCB  [GEN_TP_PCB]  (value not drawn)  (no BOM)
TP35  PCB  [GEN_TP_PCB]  (value not drawn)  (no BOM)
TP36  PCB  [GEN_TP_PCB]  (value not drawn)  (no BOM)
TP37  PCB  [GEN_TP_PCB]  (value not drawn)  (no BOM)
TP38  PCB  [GEN_TP_PCB]  (value not drawn)  (no BOM)
TP39  PCB  [GEN_TP_PCB]  (value not drawn)  (no BOM)
TP41  PCB  [GEN_TP_PCB]  (value not drawn)  (no BOM)
U10  TPS7A9101  [TI_WSON10_DSK0010A]
U11  HMCAD1511  [AD_QFN48_LP7]
U12  TPS7A2033  [GEN_SOT23_5_950_2900X1600X1450]
U13  LMK61E2-SIAT  [TI_QFM8_SIA0008B]

### Ports
ACQ_EN (in), ADC_CSn (in), ADC_PD (in), ADC_PG (out), ADC_RSTn (in), ADC_SCLK (in), ADC_SDATA (in), D1A_N (out), D1A_P (out), D1B_N (out), D1B_P (out), D2A_N (out), D2A_P (out), D2B_N (out), D2B_P (out), D3A_N (out), D3A_P (out), D3B_N (out), D3B_P (out), D4A_N (out), D4A_P (out), D4B_N (out), D4B_P (out), FCLK_N (out), FCLK_P (out), IN1_N (in), IN1_P (in), IN2_N (in), IN2_P (in), IN3_N (in), IN3_P (in), IN4_N (in), IN4_P (in), LCLK_N (out), LCLK_P (out), OSC_OE (in), OSC_SCL (in), OSC_SDA (in), VCM (out)

### Nets
+1V8A: C40.2 C41.2 C42.2 C43.2 C44.2 C45.2 C53.2 C54.2 C55.2 FB1.2 U11.1(AVDD) U11.32(AVDD2) U11.36(AVDD)
+1V8D: C46.2 C47.2 C48.2 C49.2 FB2.2 U11.7(DVDD) U11.30(DVDD)
+3V3: C56.2 C57.2 R56.1 R60.2 R61.2 R62.2 R63.2 R76.2 R77.2 TP27.1 U11.33(OVDD)
+3V3A: C60.2 C61.2 C62.2 TP36.1 U12.5(OUT) U13.6(VDD)
+5V5: R66.1 TP37.1
GND: C40.1 C41.1 C42.1 C43.1 C44.1 C45.1 C46.1 C47.1 C48.1 C49.1 C51.1 C52.1 C53.1 C54.1 C55.1 C56.1 C57.1 C58.1 C59.1 C60.1 C61.1 C62.1 J4.2(SHIELD) J5.2(SHIELD) R58.1 R59.1 R67.1 R72.1 R74.1 R75.1 U10.4(GND) U10.11(PAD) U11.8(DVSS) U11.29(DVSS) U11.31(AVSS2) U11.39(AVSS) U11.42(AVSS) U11.45(AVSS) U11.49(EPAD) U12.2(GND) U13.2(ADD) U13.3(GND)
ACQ_EN: R58.2 R67.2 TP34.1 U10.7(EN) U12.3(EN) ; port ACQ_EN
ADC_CLK_N: J4.1(Signal) R73.1 R75.2 U13.5(OUTN)
ADC_CLK_P: J5.1(Signal) R70.1 R74.2 U13.4(OUTP)
ADC_CSn: R60.1 TP28.1 U11.2(CSn) ; port ADC_CSn
ADC_PD: R62.1 TP30.1 U11.6(PD) ; port ADC_PD
ADC_PG: R63.1 TP31.1 U10.5(PG) ; port ADC_PG
ADC_RSTn: R61.1 TP29.1 U11.5(RSTn) ; port ADC_RSTn
ADC_SCLK: TP33.1 U11.4(SCLK) ; port ADC_SCLK
ADC_SDATA: TP32.1 U11.3(SDATA) ; port ADC_SDATA
CH1_N: R64.2 U11.47(IN1+) ; port IN1_N
CH1_P: R64.1 U11.46(IN1-) ; port IN1_P
CH2_N: R65.2 U11.44(IN2+) ; port IN2_N
CH2_P: R65.1 U11.43(IN2-) ; port IN2_P
CH3_N: R68.2 U11.41(IN3+) ; port IN3_N
CH3_P: R68.1 U11.40(IN3-) ; port IN3_P
CH4_N: R69.2 U11.38(IN4+) ; port IN4_N
CH4_P: R69.1 U11.37(IN4-) ; port IN4_P
D1A_N: U11.10(D1A-) ; port D1A_N
D1A_P: U11.9(D1A+) ; port D1A_P
D1B_N: U11.12(D1B-) ; port D1B_N
D1B_P: U11.11(D1B+) ; port D1B_P
D2A_N: U11.14(D2A-) ; port D2A_N
D2A_P: U11.13(D2A+) ; port D2A_P
D2B_N: U11.16(D2B-) ; port D2B_N
D2B_P: U11.15(D2B+) ; port D2B_P
D3A_N: U11.22(D3A-) ; port D3A_N
D3A_P: U11.21(D3A+) ; port D3A_P
D3B_N: U11.24(D3B-) ; port D3B_N
D3B_P: U11.23(D3B+) ; port D3B_P
D4A_N: U11.26(D4A-) ; port D4A_N
D4A_P: U11.25(D4A+) ; port D4A_P
D4B_N: U11.28(D4B-) ; port D4B_N
D4B_P: U11.27(D4B+) ; port D4B_P
FCLK_N: U11.20(FCLK-) ; port FCLK_N
FCLK_P: U11.19(FCLK+) ; port FCLK_P
LCLK_N: U11.18(LCLK-) ; port LCLK_N
LCLK_P: U11.17(LCLK+) ; port LCLK_P
OSC_OE: R72.2 TP38.1 U13.1(OE) ; port OSC_OE
SCL: R77.1 TP41.1 U13.8(SCL) ; port OSC_SCL
SDA: R76.1 TP39.1 U13.7(SDA) ; port OSC_SDA
VCM: U11.48(VCM) ; port VCM
NetC50_1: C50.1 R57.1 R59.2 U10.3(FB)
NetC50_2: C50.2 C52.2 FB1.1 FB2.1 R57.2 TP26.1 U10.1(OUT) U10.2(OUT)
NetC51_2: C51.2 R56.2 TP25.1 U10.6(SS_CTRL) U10.9(IN) U10.10(IN)
NetC58_2: C58.2 U10.8(NR/SS)
NetC59_2: C59.2 R66.2 TP35.1 U12.1(IN)
NetR70_2: R70.2 R71.2 U11.35(CLK+)
NetR71_1: R71.1 R73.2 U11.34(CLK-)

Not connected (* = marked no-connect by the designer): U12 4(NC)*

### Layout directives
differential pair: ADC_CLK_N, ADC_CLK_P

### Notes on the sheet
- All inputs have polarity swapped
- Use ADC reg 0x24 to invert
- I2C Address: 1011000

### Library data of the parts
C40 C41 C48 C49 C53 C57 C59 C61 = CAP 1uF 25V X5R 0402: Voltage Rating: 25V; Package: 0402; Supplier 1: Digi-Key; Supplier Part Number 1: 490-10017-1-ND; Value: 1uF
C42 C43 C46 C47 C50 C54 C56 = CAP 10nF 50V X7R 0402: Voltage Rating: 50V; Package: 0402; Supplier 1: Digi-Key; Supplier Part Number 1: 490-4762-1-ND; Value: 10nF
C44 C45 C55 = CAP 1nF 50V C0G 0402: Voltage Rating: 50V; Package: 0402; Supplier 1: Digi-Key; Supplier Part Number 1: 490-6189-1-ND; Value: 1nF
C51 C52 C60 = CAP 10uF 10V X5R 0603: Voltage Rating: 10V; Package: 0402; Supplier 1: Digi-Key; Supplier Part Number 1: 490-10474-1-ND; Value: 10uF
C58 C62 = CAP 100nF 16V X7R 0402: Voltage Rating: 16V; Package: 0402; Supplier 1: Digi-Key; Supplier Part Number 1: 490-4759-1-ND; Value: 100nF
FB1 FB2 = FERRITE BEAD 120 OHM 0402: Supplier 1: Digi-Key; Supplier Part Number 1: 490-9656-1-ND
J4 J5 = UFL Jack SMD: Supplier 1: Digi-Key; Supplier Part Number 1: A145155CT-ND
R56 = RES 0.01 OHM 1% 1/4W 0603: Tolerance: 1%; Power Rating: 0.25W; Supplier 1: Digi-Key; Supplier Part Number 1: 408-1404-1-ND; Value: 0.01; Package: 0603
R57 = RES 1.24K OHM 1% 1/16W 0402: Tolerance: 1%; Power Rating: 0.0625W; Package: 0402; Value: 1.24K; Supplier 1: Digi-Key; Supplier Part Number 1: 311-1.24KLRCT-ND
R58 R60-R63 R67 R72 R76 R77 = RES 10K OHM 1% 1/10W 0402: Tolerance: 1%; Power Rating: 0.1W; Package: 0402; Supplier 1: Digi-Key; Supplier Part Number 1: P10.0KLCT-ND; Value: 10K
R59 = RES 1K OHM 1% 1/10W 0402: Tolerance: 1%; Power Rating: 0.1W; Package: 0402; Supplier 1: Digi-Key; Supplier Part Number 1: P1.00KLCT-ND; Value: 1K
R64 R65 R68 R69 R71 = RES 100 OHM 1% 1/10W 0402: Tolerance: 1%; Power Rating: 0.1W; Package: 0402; Value: 100; Supplier 1: Digi-Key; Supplier Part Number 1: P100LCT-ND
R66 = RES 0.1 OHM 1% 1/6W 0402: Tolerance: 1%; Power Rating: 0.16W; Package: 0402; Supplier 1: Digi-Key; Supplier Part Number 1: P.10AKCT-ND; Value: 0.1
R70 R73 = RES 0 OHM 1/16W 0402: Power Rating: 0.0625W; Package: 0402; Supplier 1: Digi-Key; Supplier Part Number 1: 311-0.0JRCT-ND; Value: 0
R74 R75 = RES 150 OHM 1% 1/16W 0402: Tolerance: 1%; Power Rating: 0.0625W; Package: 0402; Value: 150; Supplier 1: Digi-Key; Supplier Part Number 1: 311-150LRCT-ND
TP25-TP39 TP41 = TP PCB 1mm
U10 = IC LDO TPS7A9101: Supplier 1: Digi-Key; Supplier Part Number 1: 296-45298-1-ND
U11 = IC ADC HMCAD1511: Supplier 1: Digi-Key; Supplier Part Number 1: 1127-1648-ND
U12 = IC LDO TPS7A2033: Supplier 1: Digi-Key; Supplier Part Number 1: 296-TPS7A2033PDBVRCT-ND
U13 = IC PROG OSC LMK61E2-SIAT: Supplier 1: Digi-Key; Supplier Part Number 1: 296-43212-1-ND

## Sheet FPGA.SchDoc
size A4
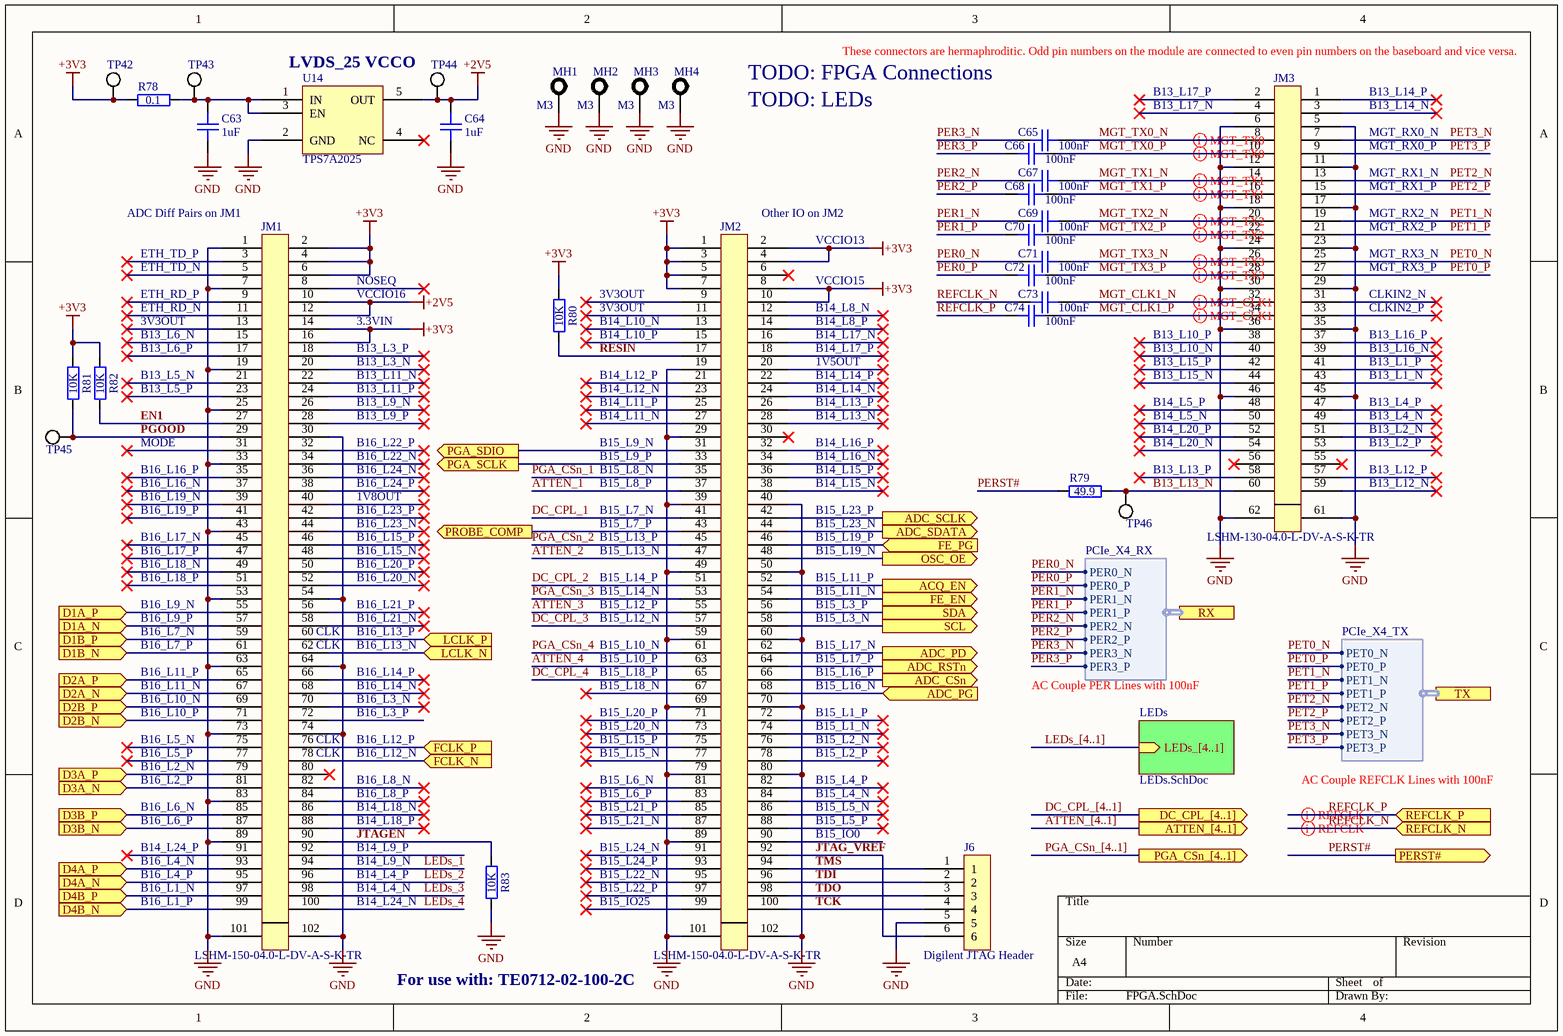
[diagram p7: FPGA.SchDoc]

### Parts
C63  1uF  [GEN_C_0402]
C64  1uF  [GEN_C_0402]
C65  100nF  [GEN_C_0402]
C66  100nF  [GEN_C_0402]
C67  100nF  [GEN_C_0402]
C68  100nF  [GEN_C_0402]
C69  100nF  [GEN_C_0402]
C70  100nF  [GEN_C_0402]
C71  100nF  [GEN_C_0402]
C72  100nF  [GEN_C_0402]
C73  100nF  [GEN_C_0402]
C74  100nF  [GEN_C_0402]
J6  2.54mm 6 Pin TH  [GEN_2.54mm_6_Pin_TH_RA]  (value not drawn)
JM1  LSHM-150-04.0-L-DV-A-S-K-TR  [SAM_LSHM-150-XX.X-XX-DV-A-S]
JM2  LSHM-150-04.0-L-DV-A-S-K-TR  [SAM_LSHM-150-XX.X-XX-DV-A-S]
JM3  LSHM-130-04.0-L-DV-A-S-K-TR  [SAM_LSHM-130-XX.X-XX-DV-A-S]
MH1  M3  [MH M3]  (no BOM)
MH2  M3  [MH M3]  (no BOM)
MH3  M3  [MH M3]  (no BOM)
MH4  M3  [MH M3]  (no BOM)
R78  0.1  [GEN_R_0402]
R79  49.9  [GEN_R_0402]
R80  10K  [GEN_R_0402]
R81  10K  [GEN_R_0402]
R82  10K  [GEN_R_0402]
R83  10K  [GEN_R_0402]
TP42  PCB  [GEN_TP_PCB]  (value not drawn)  (no BOM)
TP43  PCB  [GEN_TP_PCB]  (value not drawn)  (no BOM)
TP44  PCB  [GEN_TP_PCB]  (value not drawn)  (no BOM)
TP45  PCB  [GEN_TP_PCB]  (value not drawn)  (no BOM)
TP46  PCB  [GEN_TP_PCB]  (value not drawn)  (no BOM)
U14  TPS7A2025  [GEN_SOT23_5_950_2900X1600X1450]

### Sub-sheets
LEDs = LEDs.SchDoc (file not in this document): LEDs_[4..1] (in)

### Ports
ACQ_EN (out), ADC_CSn (out), ADC_PD (out), ADC_PG (in), ADC_RSTn (out), ADC_SCLK (out), ADC_SDATA (out), ATTEN_[4..1] (out), D1A_N (in), D1A_P (in), D1B_N (in), D1B_P (in), D2A_N (in), D2A_P (in), D2B_N (in), D2B_P (in), D3A_N (in), D3A_P (in), D3B_N (in), D3B_P (in), D4A_N (in), D4A_P (in), D4B_N (in), D4B_P (in), DC_CPL_[4..1] (out), FCLK_N (in), FCLK_P (in), FE_EN (out), FE_PG (in), LCLK_N (in), LCLK_P (in), OSC_OE (out), PERST# (out), PGA_CSn_[4..1] (out), PGA_SCLK (out), PGA_SDIO (out), PROBE_COMP (out), REFCLK_N (in), REFCLK_P (in), RX (harness PCIe_X4_RX), SCL (out), SDA (out), TX (harness PCIe_X4_TX)

### Harnesses
PCIe_X4_RX: PER0_N, PER0_P, PER1_N, PER1_P, PER2_N, PER2_P, PER3_N, PER3_P
PCIe_X4_TX: PET0_N, PET0_P, PET1_N, PET1_P, PET2_N, PET2_P, PET3_N, PET3_P

### Nets
+2V5: C64.2 JM1.10 JM1.12 TP44.1 U14.5(OUT)
+3V3: JM1.2 JM1.4 JM1.6 JM1.14 JM1.16 JM2.1 JM2.2 JM2.3 JM2.4 JM2.5 JM2.7 JM2.8 JM2.10 R78.1 R80.2 R81.2 R82.2 TP42.1
GND: C63.1 C64.1 J6.5 JM1.1 JM1.7 JM1.19 JM1.25 JM1.30 JM1.33 JM1.43 JM1.53 JM1.54 JM1.63 JM1.64 JM1.73 JM1.74 JM1.83 JM1.89 JM1.101 JM1.102 JM2.19 JM2.29 JM2.39 JM2.40 JM2.49 JM2.50 JM2.59 JM2.60 JM2.69 JM2.70 JM2.79 JM2.80 JM2.89 JM2.101 JM2.102 JM3.5 JM3.6 JM3.11 JM3.12 JM3.17 JM3.18 JM3.23 JM3.24 JM3.29 JM3.30 JM3.35 JM3.36 JM3.45 JM3.46 JM3.61 JM3.62 MH1.1 MH2.1 MH3.1 MH4.1 R83.1 U14.2(GND)
ACQ_EN: JM2.52 ; port ACQ_EN
ADC_CSn: JM2.66 ; port ADC_CSn
ADC_PD: JM2.62 ; port ADC_PD
ADC_PG: JM2.68 ; port ADC_PG
ADC_RSTn: JM2.64 ; port ADC_RSTn
ADC_SCLK: JM2.42 ; port ADC_SCLK
ADC_SDATA: JM2.44 ; port ADC_SDATA
ATTEN_1: JM2.37  [project net ATTEN]
ATTEN_2: JM2.47  [project net ATTEN]
ATTEN_3: JM2.55  [project net ATTEN]
ATTEN_4: JM2.63  [project net ATTEN]
B13_L13_N: JM3.60 R79.2 TP46.1
D1A_N: JM1.57 ; port D1A_N
D1A_P: JM1.55 ; port D1A_P
D1B_N: JM1.61 ; port D1B_N
D1B_P: JM1.59 ; port D1B_P
D2A_N: JM1.67 ; port D2A_N
D2A_P: JM1.65 ; port D2A_P
D2B_N: JM1.71 ; port D2B_N
D2B_P: JM1.69 ; port D2B_P
D3A_N: JM1.81 ; port D3A_N
D3A_P: JM1.79 ; port D3A_P
D3B_N: JM1.87 ; port D3B_N
D3B_P: JM1.85 ; port D3B_P
D4A_N: JM1.95 ; port D4A_N
D4A_P: JM1.93 ; port D4A_P
D4B_N: JM1.99 ; port D4B_N
D4B_P: JM1.97 ; port D4B_P
DC_CPL_1: JM2.41  [project net DC_CPL]
DC_CPL_2: JM2.51  [project net DC_CPL]
DC_CPL_3: JM2.57  [project net DC_CPL]
DC_CPL_4: JM2.65  [project net DC_CPL]
EN1: JM1.27 R82.1
FCLK_N: JM1.78 ; port FCLK_N
FCLK_P: JM1.76 ; port FCLK_P
FE_EN: JM2.54 ; port FE_EN
FE_PG: JM2.46 ; port FE_PG
JTAG_VREF: J6.6 JM2.92
JTAGEN: JM1.90 R83.2
LCLK_N: JM1.62 ; port LCLK_N
LCLK_P: JM1.60 ; port LCLK_P
LEDs_1: JM1.94
LEDs_2: JM1.96
LEDs_3: JM1.98
LEDs_4: JM1.100
MGT_CLK1_N: C73.1 JM3.32
MGT_CLK1_P: C74.1 JM3.34
MGT_TX0_N: C65.1 JM3.8
MGT_TX0_P: C66.1 JM3.10
MGT_TX1_N: C67.1 JM3.14
MGT_TX1_P: C68.1 JM3.16
MGT_TX2_N: C69.1 JM3.20
MGT_TX2_P: C70.1 JM3.22
MGT_TX3_N: C71.1 JM3.26
MGT_TX3_P: C72.1 JM3.28
OSC_OE: JM2.48 ; port OSC_OE
PER0_N: C71.2 ; port RX.PER0_N
PER0_P: C72.2 ; port RX.PER0_P
PER1_N: C69.2 ; port RX.PER1_N
PER1_P: C70.2 ; port RX.PER1_P
PER2_N: C67.2 ; port RX.PER2_N
PER2_P: C68.2 ; port RX.PER2_P
PER3_N: C65.2 ; port RX.PER3_N
PER3_P: C66.2 ; port RX.PER3_P
PERST#: R79.1 ; port PERST#
PET0_N: JM3.25 ; port TX.PET0_N
PET0_P: JM3.27 ; port TX.PET0_P
PET1_N: JM3.19 ; port TX.PET1_N
PET1_P: JM3.21 ; port TX.PET1_P
PET2_N: JM3.13 ; port TX.PET2_N
PET2_P: JM3.15 ; port TX.PET2_P
PET3_N: JM3.7 ; port TX.PET3_N
PET3_P: JM3.9 ; port TX.PET3_P
PGA_CSn_1: JM2.35  [project net PGA_CSn]
PGA_CSn_2: JM2.45  [project net PGA_CSn]
PGA_CSn_3: JM2.53  [project net PGA_CSn]
PGA_CSn_4: JM2.61  [project net PGA_CSn]
PGA_SCLK: JM2.33 ; port PGA_SCLK
PGA_SDIO: JM2.31 ; port PGA_SDIO
PGOOD: JM1.29 R81.1 TP45.1
PROBE_COMP: JM2.43 ; port PROBE_COMP
REFCLK_N: C73.2 ; port REFCLK_N
REFCLK_P: C74.2 ; port REFCLK_P
RESIN: JM2.17 R80.1
SCL: JM2.58 ; port SCL
SDA: JM2.56 ; port SDA
TCK: J6.4 JM2.100
TDI: J6.2 JM2.96
TDO: J6.3 JM2.98
TMS: J6.1 JM2.94
NetC63_2: C63.2 R78.2 TP43.1 U14.1(IN) U14.3(EN)

Not connected (* = marked no-connect by the designer): JM1 3* 5* 8* 9* 11* 13* 15* 17* 18* 20* 21* 22* 23* 24* 26* 28* 31* 32* 34* 35* 36* 37* 38* 39* 40* 41* 42* 44* 45* 46* 47* 48* 49* 50* 51* 52* 56* 58* 66* 68* 70* 72 75* 77* 80* 82* 84* 86* 88* 91* 92; JM2 6* 9* 11* 12* 13* 14* 15* 16* 18* 20* 21* 22* 23* 24* 25* 26* 27* 28* 30* 32* 34* 36* 38* 67* 71* 72* 73* 74* 75* 76* 77* 78* 81* 82* 83* 84* 85* 86* 87* 88* 90 91* 93* 95* 97* 99*; JM3 1* 2* 3* 4* 31* 33* 37* 38* 39* 40* 41* 42* 43* 44* 47* 48* 49* 50* 51* 52* 53* 54* 55* 56* 57* 58* 59*; U14 4(NC)*

### Buses and harness runs
bus ATTEN_[4..1] = port ATTEN_[4..1]
bus DC_CPL_[4..1] = port DC_CPL_[4..1]
bus LEDs_[4..1] = sheet LEDs/LEDs_[4..1]
bus PGA_CSn_[4..1] = port PGA_CSn_[4..1]

### Layout directives
differential pair: MGT_CLK1_N, MGT_CLK1_P, MGT_TX0_N, MGT_TX0_P, MGT_TX1_N, MGT_TX1_P, MGT_TX2_N, MGT_TX2_P, MGT_TX3_N, MGT_TX3_P, REFCLK_N, REFCLK_P

### Notes on the sheet
- (near U14) LVDS_25 VCCO
- TODO: FPGA Connections
- TODO: LEDs
- (near JM3) These connectors are hermaphroditic. Odd pin numbers on the module are connected to even pin numbers on the baseboard and vice versa.
- B13_L17_P
- B13_L17_N
- B13_L14_P
- B13_L14_N
- MGT_RX1_N
- MGT_RX0_N
- MGT_RX0_P
- (near JM1) ADC Diff Pairs on JM1
- (near JM2) Other IO on JM2
- VCCIO13
- MGT_RX2_N
- MGT_RX2_P
- MGT_RX1_P
- ETH_TD_P
- ETH_TD_N
- ETH_RD_P
- ETH_RD_N
- VCCIO16
- NOSEQ
- (near R80) 3V3OUT
- VCCIO15
- B14_L8_N
- MGT_RX3_N
- MGT_RX3_P
- CLKIN2_N
- CLKIN2_P
- 3V3OUT
- B13_L6_N
- (near R82) B13_L6_P
- (near R82) B13_L5_N
- 3.3VIN
- B13_L3_P
- B13_L3_N
- B13_L11_N
- (near R80) B14_L10_N
- (near R80) B14_L10_P
- B14_L12_P
- B14_L8_P
- B14_L17_N
- B14_L17_P
- 1V5OUT
- B14_L14_P
- B13_L10_P
- B13_L10_N
- B13_L15_P
- B13_L15_N
- B13_L16_P
- B13_L16_N
- B13_L1_P
- B13_L1_N
- (near R82) B13_L5_P
- MODE
- B13_L11_P
- B13_L9_N
- B13_L9_P
- B16_L22_P
- B14_L12_N
- B14_L11_P
- B14_L11_N
- B15_L9_N
- B14_L14_N
- B14_L13_P
- B14_L13_N
- B14_L16_P
- B14_L5_P
- B14_L5_N
- B14_L20_P
- B14_L20_N
- B13_L4_P
- B13_L4_N
- B13_L2_N
- B13_L2_P
- B16_L16_P
- B16_L16_N
- B16_L19_N
- B16_L19_P
- B16_L22_N
- B16_L24_N
- B16_L24_P
- 1V8OUT
- B16_L23_P
- B15_L9_P
- B15_L8_N
- B15_L8_P
- B15_L7_N
- B14_L16_N
- B14_L15_P
- B14_L15_N
- B15_L23_P
- B13_L13_P
- B13_L12_P
- B13_L12_N
- B16_L17_N
- B16_L17_P
- B16_L18_N
- B16_L18_P
- B16_L23_N
- B16_L15_P
- B16_L15_N
- B16_L20_P
- B16_L20_N
- B15_L7_P
- B15_L13_P
- B15_L13_N
- B15_L14_P
- B15_L23_N
- B15_L19_P
- B15_L19_N
- B15_L11_P
- B16_L9_N
- B16_L9_P
- B16_L7_N
- B16_L7_P
- (near JM1) CLK
- B16_L21_P
- B16_L21_N
- B16_L13_P
- B16_L13_N
- B15_L14_N
- B15_L12_P
- B15_L12_N
- B15_L10_N
- B15_L11_N
- B15_L3_P
- B15_L3_N
- B15_L17_N
- B16_L11_P
- B16_L11_N
- B16_L10_N
- B16_L10_P
- B16_L14_P
- B16_L14_N
- B16_L3_N
- B16_L3_P
- B15_L10_P
- B15_L18_P
- B15_L18_N
- B15_L20_P
- B15_L1_P
- B15_L17_P
- B15_L16_P
- B15_L16_N
- AC Couple PER Lines with 100nF
- B16_L5_N
- B16_L5_P
- B16_L2_N
- B16_L2_P
- B16_L8_N
- B16_L12_P
- B16_L12_N
- B15_L20_N
- B15_L15_P
- B15_L15_N
- B15_L6_N
- B15_L1_N
- B15_L2_N
- B15_L2_P
- B15_L4_P
- AC Couple REFCLK Lines with 100nF
- B14_L24_P
- B16_L6_N
- B16_L6_P
- B16_L8_P
- B14_L18_N
- B14_L18_P
- B14_L9_P
- B15_L6_P
- B15_L21_P
- B15_L21_N
- B15_L24_N
- B15_L4_N
- B15_L5_N
- B15_L5_P
- B15_IO0
- B16_L4_N
- B16_L4_P
- B16_L1_N
- B16_L1_P
- B14_L9_N
- B14_L4_P
- B14_L4_N
- B14_L24_N
- B15_L24_P
- B15_L22_N
- B15_L22_P
- B15_IO25
- For use with: TE0712-02-100-2C
- (near J6) Digilent JTAG Header

### Library data of the parts
C63 C64 = CAP 1uF 25V X5R 0402: Voltage Rating: 25V; Package: 0402; Supplier 1: Digi-Key; Supplier Part Number 1: 490-10017-1-ND; Value: 1uF
C65-C74 = CAP 100nF 16V X7R 0402: Voltage Rating: 16V; Package: 0402; Supplier 1: Digi-Key; Supplier Part Number 1: 490-4759-1-ND; Value: 100nF
J6 = CONN 2.54mm 6 Pin TH RA: Supplier 1: Digi-Key; Supplier Part Number 1: 732-5339-ND
JM1 JM2 = CONN LSHM-150-04.0-L-DV-A-S-K-TR: Supplier 1: Digi-Key; Supplier Part Number 1: SAM9033CT-ND
JM3 = CONN LSHM-130-04.0-L-DV-A-S-K-TR: Supplier 1: Digi-Key; Supplier Part Number 1: SAM9034CT-ND
MH1-MH4 = MH M3
R78 = RES 0.1 OHM 1% 1/6W 0402: Tolerance: 1%; Power Rating: 0.16W; Package: 0402; Supplier 1: Digi-Key; Supplier Part Number 1: P.10AKCT-ND; Value: 0.1
R79 = RES 49.9 OHM 1% 1/10W 0402: Tolerance: 1%; Power Rating: 0.1W; Package: 0402; Supplier 1: Digi-Key; Supplier Part Number 1: 311-49.9LRCT-ND; Value: 49.9
R80-R83 = RES 10K OHM 1% 1/10W 0402: Tolerance: 1%; Power Rating: 0.1W; Package: 0402; Supplier 1: Digi-Key; Supplier Part Number 1: P10.0KLCT-ND; Value: 10K
TP42-TP46 = TP PCB 1mm
U14 = IC LDO TPS7A2025: Supplier 1: Digi-Key; Supplier Part Number 1: 296-TPS7A2025PDBVRCT-ND